# EasyEDA Pro project EasyEda.epro, board Right Hand
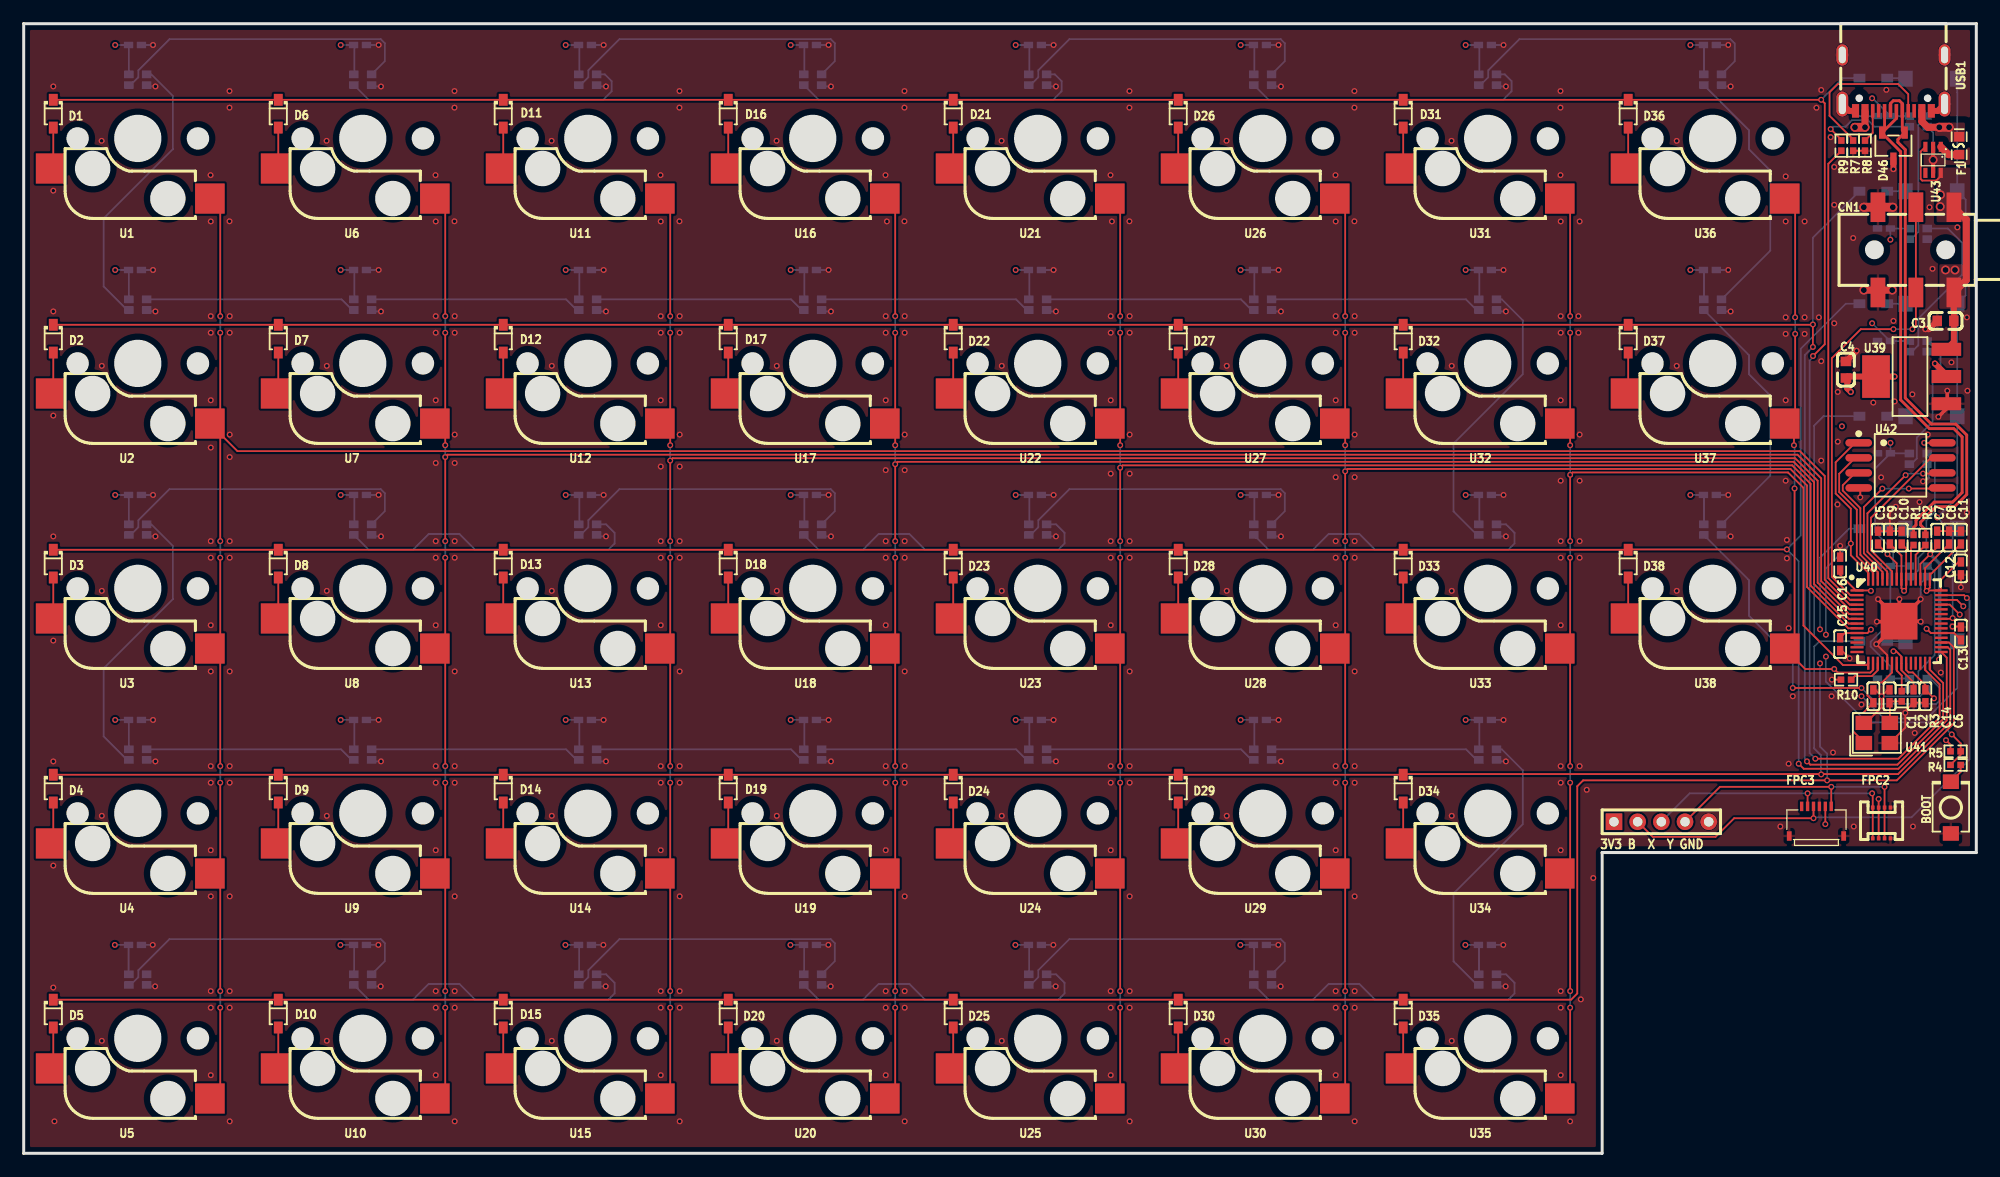
[diagram p7: board, top side]
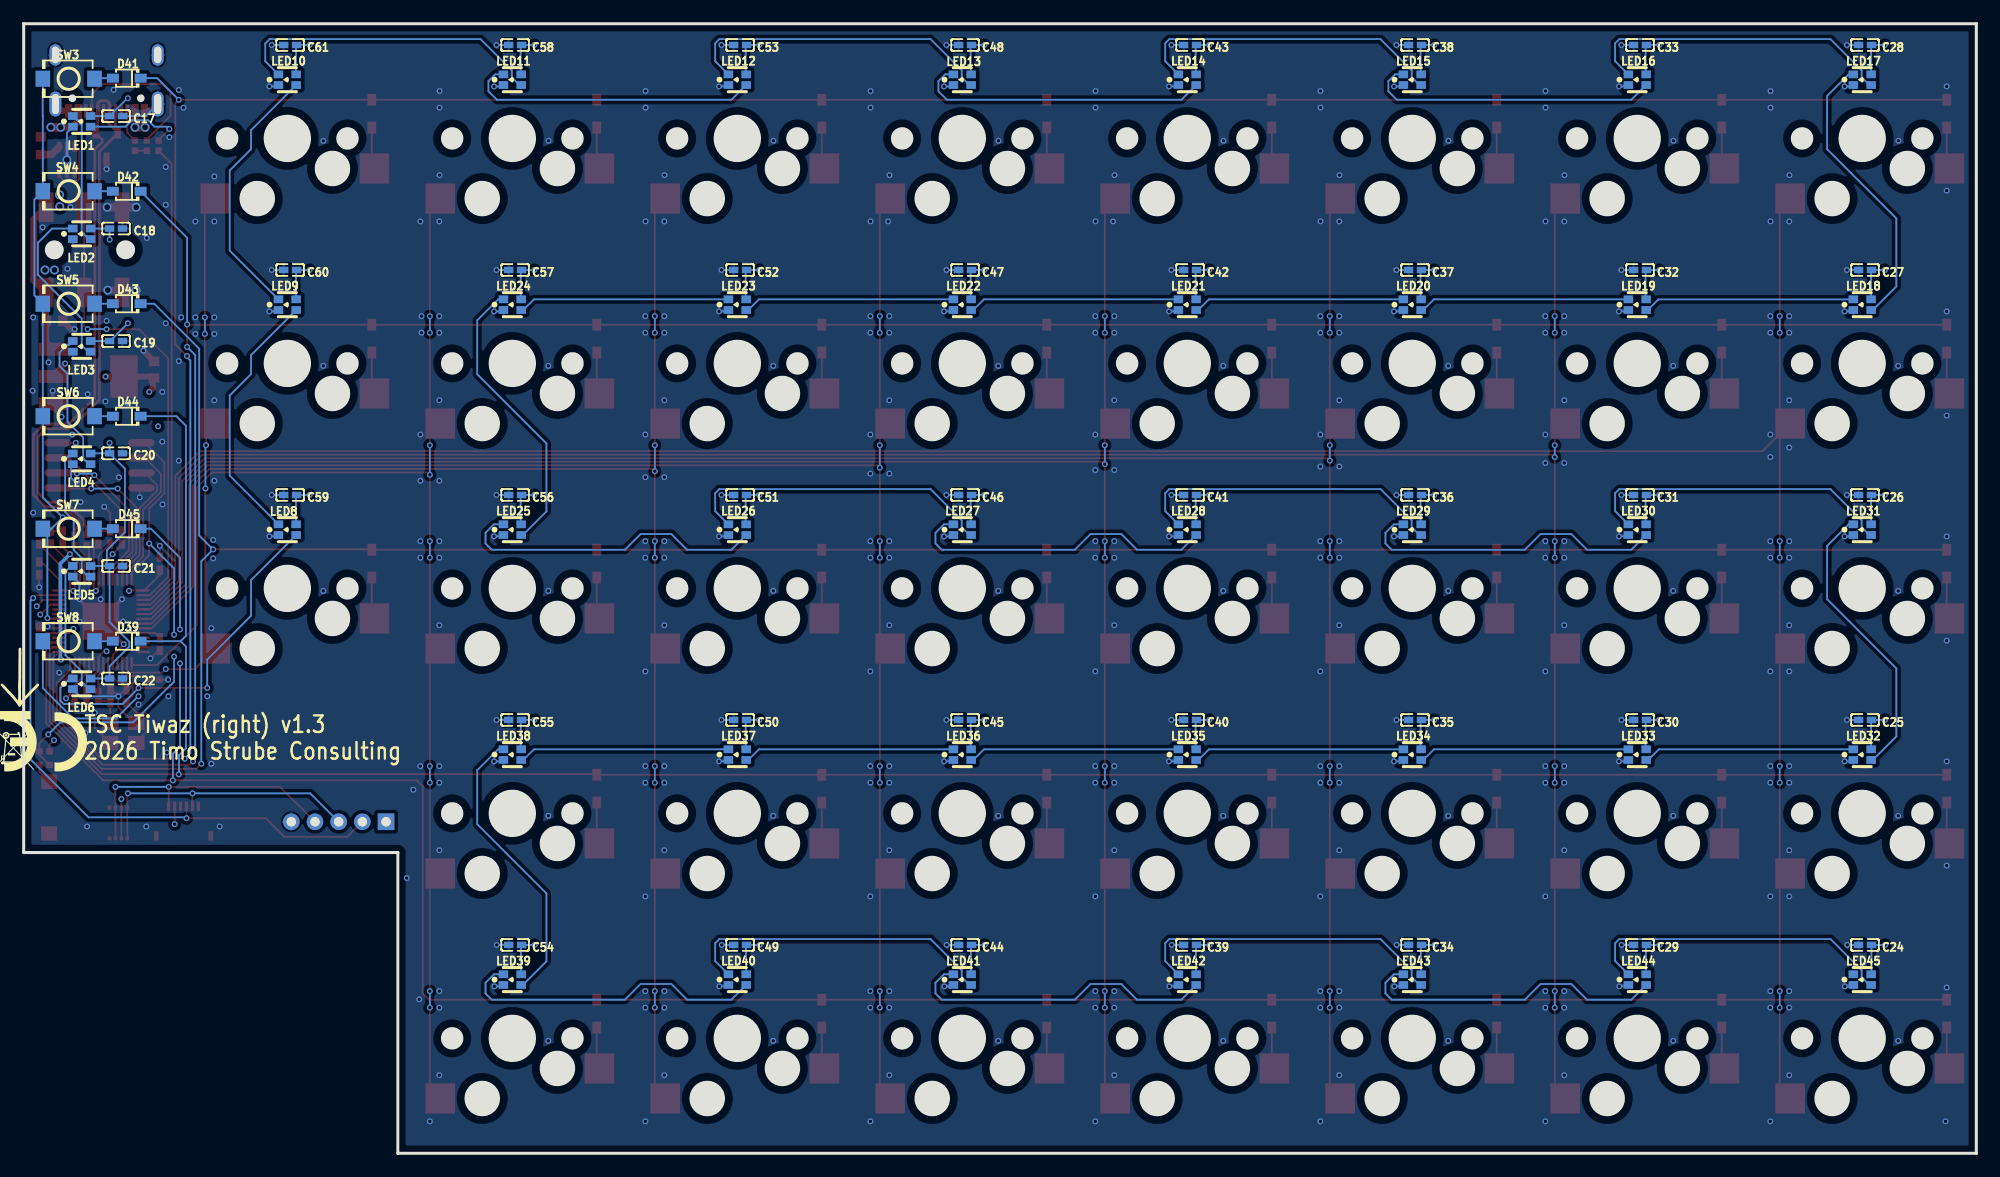
[diagram p8: board, bottom side, seen from below]

Outline 164.9 x 95.4 mm; copper layers: Top Layer, Inner1, Inner2, Bottom Layer. Coordinates in mm from the lower left corner of the outline.
Outline path: 0,95.4 164.9,95.4 164.9,25.4 133.3,25.4 133.3,0 0,0 0,95.4
Stack: Top Layer 0.035mm Outer layer thickness 1oz / Dielectric1 0.2104mm 7628 RC49% 8.6mil / Inner1 0.0152mm Inner layer thickness / Dielectric2 1.065mm 1.1mm H/HOZ Copper / Inner2 0.0152mm Inner layer thickness / Dielectric3 0.2104mm 7628 RC49% 8.6mil / Bottom Layer 0.035mm Outer layer thickness 1oz

## Design rules (mm)
template: User Custom Config
spacing Default (default): track to track 0.15, other pairs 0 to 1
track width Default (default): min 0.15, default 0.15, max 25.4
differential pair differentialPair (default): width min 0.127, default 0.254, max 2.54; gap min 0.152, default 0.152
differential pair USB 12Mbps: width min 0.24, default 0.24, max 0.24; gap min 0.15, default 0.15
via Default (default): diameter min 0.5, default 0.5, max 100.025; hole min 0.3, default 0.3, max 59.995
net $1I35159\$1N29010 uses Full
net $1I35159\VBUS uses PWR
pour e92 uses Full
pour e10568 uses Full
pour e11129 uses PWR

## Placement (name value [footprint] x y rotation side)
BOOT  TS-1088-AR02016  [SW-SMD_L3.9-W3.0-P4.45]  162.75 29.2 90 top
C1  15pF  [C0402]  156.21 38.6 90 top
C2  15pF  [C0402]  157.57 38.6 270 top
C3  10uF  [C0603]  162.3 70.3 0 top
C4  10uF  [C0603]  153.89 66.18 270 top
C5  100nF  [C0402]  156.6 52 270 top
C6  100nF  [C0402]  160.6 38.6 90 top
C7  1uF  [C0402]  161.6 52 270 top
C8  1uF  [C0402]  162.6 52 90 top
C9  100nF  [C0402]  157.6 52 270 top
C10  100nF  [C0402]  158.6 52 270 top
C11  100nF  [C0402]  163.6 52 270 top
C12  100nF  [C0402]  163.6 49.4 90 top
C13  100nF  [C0402]  163.6 43.9 270 top
C14  100nF  [C0402]  159.6 38.6 90 top
C15  100nF  [C0402]  153.4 43 90 top
C16  100nF  [C0402]  153.4 49.8 270 top
C17  100nF  [C0402]  157.1 87.6 0 bottom
C18  100nF  [C0402]  157.1 78.1 0 bottom
C19  100nF  [C0402]  157.1 68.6 0 bottom
C20  100nF  [C0402]  157.1 59.12 0 bottom
C21  100nF  [C0402]  157.1 49.6 0 bottom
C22  100nF  [C0402]  157.1 40.1 0 bottom
C24  100nF  [C0402]  9.4 17.6 180 bottom
C25  100nF  [C0402]  9.4 36.6 180 bottom
C26  100nF  [C0402]  9.4 55.6 180 bottom
C27  100nF  [C0402]  9.4 74.6 180 bottom
C28  100nF  [C0402]  9.4 93.6 180 bottom
C29  100nF  [C0402]  28.4 17.6 180 bottom
C30  100nF  [C0402]  28.4 36.6 180 bottom
C31  100nF  [C0402]  28.4 55.6 180 bottom
C32  100nF  [C0402]  28.4 74.6 180 bottom
C33  100nF  [C0402]  28.4 93.6 180 bottom
C34  100nF  [C0402]  47.4 17.6 180 bottom
C35  100nF  [C0402]  47.4 36.6 180 bottom
C36  100nF  [C0402]  47.4 55.6 180 bottom
C37  100nF  [C0402]  47.4 74.6 180 bottom
C38  100nF  [C0402]  47.4 93.6 180 bottom
C39  100nF  [C0402]  66.4 17.6 180 bottom
C40  100nF  [C0402]  66.4 36.6 180 bottom
C41  100nF  [C0402]  66.4 55.6 180 bottom
C42  100nF  [C0402]  66.4 74.6 180 bottom
C43  100nF  [C0402]  66.4 93.6 180 bottom
C44  100nF  [C0402]  85.4 17.6 180 bottom
C45  100nF  [C0402]  85.4 36.6 180 bottom
C46  100nF  [C0402]  85.4 55.6 180 bottom
C47  100nF  [C0402]  85.4 74.6 180 bottom
C48  100nF  [C0402]  85.4 93.6 180 bottom
C49  100nF  [C0402]  104.4 17.6 180 bottom
C50  100nF  [C0402]  104.4 36.6 180 bottom
C51  100nF  [C0402]  104.4 55.6 180 bottom
C52  100nF  [C0402]  104.4 74.6 180 bottom
C53  100nF  [C0402]  104.4 93.6 180 bottom
C54  100nF  [C0402]  123.4 17.6 180 bottom
C55  100nF  [C0402]  123.4 36.6 180 bottom
C56  100nF  [C0402]  123.4 55.6 180 bottom
C57  100nF  [C0402]  123.4 74.6 180 bottom
C58  100nF  [C0402]  123.4 93.6 180 bottom
C59  100nF  [C0402]  142.4 55.6 180 bottom
C60  100nF  [C0402]  142.4 74.6 180 bottom
C61  100nF  [C0402]  142.4 93.6 180 bottom
CN1  PJ-313D  [AUDIO-SMD_PJ-313D-2]  159.8 76.3 270 top
D1  1N4148WS  [SOD-323_L1.8-W1.3-LS2.5-RD]  2.5 87.8 270 top
D2  1N4148WS  [SOD-323_L1.8-W1.3-LS2.5-RD]  2.5 68.8 270 top
D3  1N4148WS  [SOD-323_L1.8-W1.3-LS2.5-RD]  2.5 49.8 270 top
D4  1N4148WS  [SOD-323_L1.8-W1.3-LS2.5-RD]  2.5 30.8 270 top
D5  1N4148WS  [SOD-323_L1.8-W1.3-LS2.5-RD]  2.5 11.8 270 top
D6  1N4148WS  [SOD-323_L1.8-W1.3-LS2.5-RD]  21.5 87.8 270 top
D7  1N4148WS  [SOD-323_L1.8-W1.3-LS2.5-RD]  21.5 68.8 270 top
D8  1N4148WS  [SOD-323_L1.8-W1.3-LS2.5-RD]  21.5 49.8 270 top
D9  1N4148WS  [SOD-323_L1.8-W1.3-LS2.5-RD]  21.5 30.8 270 top
D10  1N4148WS  [SOD-323_L1.8-W1.3-LS2.5-RD]  21.5 11.8 270 top
D11  1N4148WS  [SOD-323_L1.8-W1.3-LS2.5-RD]  40.5 87.8 270 top
D12  1N4148WS  [SOD-323_L1.8-W1.3-LS2.5-RD]  40.5 68.8 270 top
D13  1N4148WS  [SOD-323_L1.8-W1.3-LS2.5-RD]  40.5 49.8 270 top
D14  1N4148WS  [SOD-323_L1.8-W1.3-LS2.5-RD]  40.5 30.8 270 top
D15  1N4148WS  [SOD-323_L1.8-W1.3-LS2.5-RD]  40.5 11.8 270 top
D16  1N4148WS  [SOD-323_L1.8-W1.3-LS2.5-RD]  59.5 87.8 270 top
D17  1N4148WS  [SOD-323_L1.8-W1.3-LS2.5-RD]  59.5 68.8 270 top
D18  1N4148WS  [SOD-323_L1.8-W1.3-LS2.5-RD]  59.5 49.8 270 top
D19  1N4148WS  [SOD-323_L1.8-W1.3-LS2.5-RD]  59.5 30.8 270 top
D20  1N4148WS  [SOD-323_L1.8-W1.3-LS2.5-RD]  59.5 11.8 270 top
D21  1N4148WS  [SOD-323_L1.8-W1.3-LS2.5-RD]  78.5 87.8 270 top
D22  1N4148WS  [SOD-323_L1.8-W1.3-LS2.5-RD]  78.5 68.8 270 top
D23  1N4148WS  [SOD-323_L1.8-W1.3-LS2.5-RD]  78.5 49.8 270 top
D24  1N4148WS  [SOD-323_L1.8-W1.3-LS2.5-RD]  78.5 30.8 270 top
D25  1N4148WS  [SOD-323_L1.8-W1.3-LS2.5-RD]  78.5 11.8 270 top
D26  1N4148WS  [SOD-323_L1.8-W1.3-LS2.5-RD]  97.5 87.8 270 top
D27  1N4148WS  [SOD-323_L1.8-W1.3-LS2.5-RD]  97.5 68.8 270 top
D28  1N4148WS  [SOD-323_L1.8-W1.3-LS2.5-RD]  97.5 49.8 270 top
D29  1N4148WS  [SOD-323_L1.8-W1.3-LS2.5-RD]  97.5 30.8 270 top
D30  1N4148WS  [SOD-323_L1.8-W1.3-LS2.5-RD]  97.5 11.8 270 top
D31  1N4148WS  [SOD-323_L1.8-W1.3-LS2.5-RD]  116.5 87.8 270 top
D32  1N4148WS  [SOD-323_L1.8-W1.3-LS2.5-RD]  116.5 68.8 270 top
D33  1N4148WS  [SOD-323_L1.8-W1.3-LS2.5-RD]  116.5 49.8 270 top
D34  1N4148WS  [SOD-323_L1.8-W1.3-LS2.5-RD]  116.5 30.8 270 top
D35  1N4148WS  [SOD-323_L1.8-W1.3-LS2.5-RD]  116.5 11.8 270 top
D36  1N4148WS  [SOD-323_L1.8-W1.3-LS2.5-RD]  135.5 87.8 270 top
D37  1N4148WS  [SOD-323_L1.8-W1.3-LS2.5-RD]  135.5 68.8 270 top
D38  1N4148WS  [SOD-323_L1.8-W1.3-LS2.5-RD]  135.5 49.8 270 top
D39  1N4148WS  [SOD-323_L1.8-W1.3-LS2.5-RD]  156.2 43.25 0 bottom
D41  1N4148WS  [SOD-323_L1.8-W1.3-LS2.5-RD]  156.2 90.8 0 bottom
D42  1N4148WS  [SOD-323_L1.8-W1.3-LS2.5-RD]  156.2 81.25 0 bottom
D43  1N4148WS  [SOD-323_L1.8-W1.3-LS2.5-RD]  156.2 71.75 0 bottom
D44  1N4148WS  [SOD-323_L1.8-W1.3-LS2.5-RD]  156.2 62.25 0 bottom
D45  1N4148WS  [SOD-323_L1.8-W1.3-LS2.5-RD]  156.2 52.75 0 bottom
D46  ESDA6V1L  [SOT-23-3_L3.0-W1.7-P0.95-LS2.9-BR]  157.9 85.1 90 top
F1  BSMD0603-100-6V  [F0603]  163.45 85.1 270 top
FPC2  FA1004SA1-R8000  [CONN-SMD_FA1004SA1-R8000]  156.9 27.9 0 top
FPC3  FH19C-6S-0.5SH(10)  [FPC-SMD_FH19C-6S-0.5SH]  151.4 28.05 0 top
H1  XY-PZ200V-11-05P  [HDR-TH_XY-PZ200V-11-05P]  138.3 28 0 top
LED1  XL-1615RGBC-WS2812B  [LED-SMD_4P-L1.6-W1.5_XL-1615RGBC-WS2812B-1]  160 87.15 180 bottom
LED2  XL-1615RGBC-WS2812B  [LED-SMD_4P-L1.6-W1.5_XL-1615RGBC-WS2812B-1]  160 77.65 180 bottom
LED3  XL-1615RGBC-WS2812B  [LED-SMD_4P-L1.6-W1.5_XL-1615RGBC-WS2812B-1]  160 68.15 180 bottom
LED4  XL-1615RGBC-WS2812B  [LED-SMD_4P-L1.6-W1.5_XL-1615RGBC-WS2812B-1]  160 58.65 180 bottom
LED5  XL-1615RGBC-WS2812B  [LED-SMD_4P-L1.6-W1.5_XL-1615RGBC-WS2812B-1]  160 49.15 180 bottom
LED6  XL-1615RGBC-WS2812B  [LED-SMD_4P-L1.6-W1.5_XL-1615RGBC-WS2812B-1]  160 39.65 180 bottom
LED8  XL-1615RGBC-WS2812B  [LED-SMD_4P-L1.6-W1.5_XL-1615RGBC-WS2812B-1]  142.63 52.67 180 bottom
LED9  XL-1615RGBC-WS2812B  [LED-SMD_4P-L1.6-W1.5_XL-1615RGBC-WS2812B-1]  142.63 71.67 180 bottom
LED10  XL-1615RGBC-WS2812B  [LED-SMD_4P-L1.6-W1.5_XL-1615RGBC-WS2812B-1]  142.63 90.67 180 bottom
LED11  XL-1615RGBC-WS2812B  [LED-SMD_4P-L1.6-W1.5_XL-1615RGBC-WS2812B-1]  123.63 90.67 180 bottom
LED12  XL-1615RGBC-WS2812B  [LED-SMD_4P-L1.6-W1.5_XL-1615RGBC-WS2812B-1]  104.63 90.67 180 bottom
LED13  XL-1615RGBC-WS2812B  [LED-SMD_4P-L1.6-W1.5_XL-1615RGBC-WS2812B-1]  85.63 90.67 180 bottom
LED14  XL-1615RGBC-WS2812B  [LED-SMD_4P-L1.6-W1.5_XL-1615RGBC-WS2812B-1]  66.63 90.67 180 bottom
LED15  XL-1615RGBC-WS2812B  [LED-SMD_4P-L1.6-W1.5_XL-1615RGBC-WS2812B-1]  47.64 90.67 180 bottom
LED16  XL-1615RGBC-WS2812B  [LED-SMD_4P-L1.6-W1.5_XL-1615RGBC-WS2812B-1]  28.64 90.67 180 bottom
LED17  XL-1615RGBC-WS2812B  [LED-SMD_4P-L1.6-W1.5_XL-1615RGBC-WS2812B-1]  9.64 90.67 180 bottom
LED18  XL-1615RGBC-WS2812B  [LED-SMD_4P-L1.6-W1.5_XL-1615RGBC-WS2812B-1]  9.64 71.67 180 bottom
LED19  XL-1615RGBC-WS2812B  [LED-SMD_4P-L1.6-W1.5_XL-1615RGBC-WS2812B-1]  28.64 71.67 180 bottom
LED20  XL-1615RGBC-WS2812B  [LED-SMD_4P-L1.6-W1.5_XL-1615RGBC-WS2812B-1]  47.64 71.67 180 bottom
LED21  XL-1615RGBC-WS2812B  [LED-SMD_4P-L1.6-W1.5_XL-1615RGBC-WS2812B-1]  66.63 71.67 180 bottom
LED22  XL-1615RGBC-WS2812B  [LED-SMD_4P-L1.6-W1.5_XL-1615RGBC-WS2812B-1]  85.63 71.67 180 bottom
LED23  XL-1615RGBC-WS2812B  [LED-SMD_4P-L1.6-W1.5_XL-1615RGBC-WS2812B-1]  104.63 71.67 180 bottom
LED24  XL-1615RGBC-WS2812B  [LED-SMD_4P-L1.6-W1.5_XL-1615RGBC-WS2812B-1]  123.63 71.67 180 bottom
LED25  XL-1615RGBC-WS2812B  [LED-SMD_4P-L1.6-W1.5_XL-1615RGBC-WS2812B-1]  123.63 52.67 180 bottom
LED26  XL-1615RGBC-WS2812B  [LED-SMD_4P-L1.6-W1.5_XL-1615RGBC-WS2812B-1]  104.63 52.67 180 bottom
LED27  XL-1615RGBC-WS2812B  [LED-SMD_4P-L1.6-W1.5_XL-1615RGBC-WS2812B-1]  85.63 52.67 180 bottom
LED28  XL-1615RGBC-WS2812B  [LED-SMD_4P-L1.6-W1.5_XL-1615RGBC-WS2812B-1]  66.63 52.67 180 bottom
LED29  XL-1615RGBC-WS2812B  [LED-SMD_4P-L1.6-W1.5_XL-1615RGBC-WS2812B-1]  47.64 52.67 180 bottom
LED30  XL-1615RGBC-WS2812B  [LED-SMD_4P-L1.6-W1.5_XL-1615RGBC-WS2812B-1]  28.64 52.67 180 bottom
LED31  XL-1615RGBC-WS2812B  [LED-SMD_4P-L1.6-W1.5_XL-1615RGBC-WS2812B-1]  9.64 52.67 180 bottom
LED32  XL-1615RGBC-WS2812B  [LED-SMD_4P-L1.6-W1.5_XL-1615RGBC-WS2812B-1]  9.64 33.67 180 bottom
LED33  XL-1615RGBC-WS2812B  [LED-SMD_4P-L1.6-W1.5_XL-1615RGBC-WS2812B-1]  28.64 33.67 180 bottom
LED34  XL-1615RGBC-WS2812B  [LED-SMD_4P-L1.6-W1.5_XL-1615RGBC-WS2812B-1]  47.64 33.67 180 bottom
LED35  XL-1615RGBC-WS2812B  [LED-SMD_4P-L1.6-W1.5_XL-1615RGBC-WS2812B-1]  66.63 33.67 180 bottom
LED36  XL-1615RGBC-WS2812B  [LED-SMD_4P-L1.6-W1.5_XL-1615RGBC-WS2812B-1]  85.63 33.67 180 bottom
LED37  XL-1615RGBC-WS2812B  [LED-SMD_4P-L1.6-W1.5_XL-1615RGBC-WS2812B-1]  104.63 33.67 180 bottom
LED38  XL-1615RGBC-WS2812B  [LED-SMD_4P-L1.6-W1.5_XL-1615RGBC-WS2812B-1]  123.63 33.67 180 bottom
LED39  XL-1615RGBC-WS2812B  [LED-SMD_4P-L1.6-W1.5_XL-1615RGBC-WS2812B-1]  123.63 14.67 180 bottom
LED40  XL-1615RGBC-WS2812B  [LED-SMD_4P-L1.6-W1.5_XL-1615RGBC-WS2812B-1]  104.63 14.67 180 bottom
LED41  XL-1615RGBC-WS2812B  [LED-SMD_4P-L1.6-W1.5_XL-1615RGBC-WS2812B-1]  85.63 14.67 180 bottom
LED42  XL-1615RGBC-WS2812B  [LED-SMD_4P-L1.6-W1.5_XL-1615RGBC-WS2812B-1]  66.63 14.67 180 bottom
LED43  XL-1615RGBC-WS2812B  [LED-SMD_4P-L1.6-W1.5_XL-1615RGBC-WS2812B-1]  47.64 14.67 180 bottom
LED44  XL-1615RGBC-WS2812B  [LED-SMD_4P-L1.6-W1.5_XL-1615RGBC-WS2812B-1]  28.64 14.67 180 bottom
LED45  XL-1615RGBC-WS2812B  [LED-SMD_4P-L1.6-W1.5_XL-1615RGBC-WS2812B-1]  9.64 14.67 180 bottom
R1  22Ω  [R0402]  159.6 51.8 270 top
R2  22Ω  [R0402]  160.6 51.8 270 top
R3  1kΩ  [R0402]  158.6 38.6 270 top
R4  1kΩ  [R0402]  163.15 32.8 0 top
R5  10kΩ  [R0402]  163.15 33.95 180 top
R7  5.1kΩ  [R0402]  154.5 85.1 90 top
R8  5.1kΩ  [R0402]  155.5 85.1 90 top
R9  330Ω  [R0402]  153.5 85.1 270 top
R10  10kΩ  [R0402]  153.9 40 180 top
SW3  TS-1088-AR02016  [SW-SMD_L3.9-W3.0-P4.45]  161.1 90.75 0 bottom
SW4  TS-1088-AR02016  [SW-SMD_L3.9-W3.0-P4.45]  161.1 81.25 0 bottom
SW5  TS-1088-AR02016  [SW-SMD_L3.9-W3.0-P4.45]  161.1 71.75 0 bottom
SW6  TS-1088-AR02016  [SW-SMD_L3.9-W3.0-P4.45]  161.1 62.25 0 bottom
SW7  TS-1088-AR02016  [SW-SMD_L3.9-W3.0-P4.45]  161.1 52.75 0 bottom
SW8  TS-1088-AR02016  [SW-SMD_L3.9-W3.0-P4.45]  161.1 43.25 0 bottom
U1  CPG151101S11-16  [SMD_KEYBOARD-SW_COMPLETE]  9 81.9 0 top
U2  CPG151101S11-16  [SMD_KEYBOARD-SW_COMPLETE]  9 62.9 0 top
U3  CPG151101S11-16  [SMD_KEYBOARD-SW_COMPLETE]  9 43.9 0 top
U4  CPG151101S11-16  [SMD_KEYBOARD-SW_COMPLETE]  9 24.9 0 top
U5  CPG151101S11-16  [SMD_KEYBOARD-SW_COMPLETE]  9 5.9 0 top
U6  CPG151101S11-16  [SMD_KEYBOARD-SW_COMPLETE]  28 81.9 0 top
U7  CPG151101S11-16  [SMD_KEYBOARD-SW_COMPLETE]  28 62.9 0 top
U8  CPG151101S11-16  [SMD_KEYBOARD-SW_COMPLETE]  28 43.9 0 top
U9  CPG151101S11-16  [SMD_KEYBOARD-SW_COMPLETE]  28 24.9 0 top
U10  CPG151101S11-16  [SMD_KEYBOARD-SW_COMPLETE]  28 5.9 0 top
U11  CPG151101S11-16  [SMD_KEYBOARD-SW_COMPLETE]  47 81.9 0 top
U12  CPG151101S11-16  [SMD_KEYBOARD-SW_COMPLETE]  47 62.9 0 top
U13  CPG151101S11-16  [SMD_KEYBOARD-SW_COMPLETE]  47 43.9 0 top
U14  CPG151101S11-16  [SMD_KEYBOARD-SW_COMPLETE]  47 24.9 0 top
U15  CPG151101S11-16  [SMD_KEYBOARD-SW_COMPLETE]  47 5.9 0 top
U16  CPG151101S11-16  [SMD_KEYBOARD-SW_COMPLETE]  66 81.9 0 top
U17  CPG151101S11-16  [SMD_KEYBOARD-SW_COMPLETE]  66 62.9 0 top
U18  CPG151101S11-16  [SMD_KEYBOARD-SW_COMPLETE]  66 43.9 0 top
U19  CPG151101S11-16  [SMD_KEYBOARD-SW_COMPLETE]  66 24.9 0 top
U20  CPG151101S11-16  [SMD_KEYBOARD-SW_COMPLETE]  66 5.9 0 top
U21  CPG151101S11-16  [SMD_KEYBOARD-SW_COMPLETE]  85 81.9 0 top
U22  CPG151101S11-16  [SMD_KEYBOARD-SW_COMPLETE]  85 62.9 0 top
U23  CPG151101S11-16  [SMD_KEYBOARD-SW_COMPLETE]  85 43.9 0 top
U24  CPG151101S11-16  [SMD_KEYBOARD-SW_COMPLETE]  85 24.9 0 top
U25  CPG151101S11-16  [SMD_KEYBOARD-SW_COMPLETE]  85 5.9 0 top
U26  CPG151101S11-16  [SMD_KEYBOARD-SW_COMPLETE]  104 81.9 0 top
U27  CPG151101S11-16  [SMD_KEYBOARD-SW_COMPLETE]  104 62.9 0 top
U28  CPG151101S11-16  [SMD_KEYBOARD-SW_COMPLETE]  104 43.9 0 top
U29  CPG151101S11-16  [SMD_KEYBOARD-SW_COMPLETE]  104 24.9 0 top
U30  CPG151101S11-16  [SMD_KEYBOARD-SW_COMPLETE]  104 5.9 0 top
U31  CPG151101S11-16  [SMD_KEYBOARD-SW_COMPLETE]  123 81.9 0 top
U32  CPG151101S11-16  [SMD_KEYBOARD-SW_COMPLETE]  123 62.9 0 top
U33  CPG151101S11-16  [SMD_KEYBOARD-SW_COMPLETE]  123 43.9 0 top
U34  CPG151101S11-16  [SMD_KEYBOARD-SW_COMPLETE]  123 24.9 0 top
U35  CPG151101S11-16  [SMD_KEYBOARD-SW_COMPLETE]  123 5.9 0 top
U36  CPG151101S11-16  [SMD_KEYBOARD-SW_COMPLETE]  142 81.9 0 top
U37  CPG151101S11-16  [SMD_KEYBOARD-SW_COMPLETE]  142 62.9 0 top
U38  CPG151101S11-16  [SMD_KEYBOARD-SW_COMPLETE]  142 43.9 0 top
U39  AMS1117-3.3  [SOT-223-3_L6.5-W3.4-P2.30-LS7.0-BR]  159.4 65.6 0 top
U40  RP2040  [LQFN-56_L7.0-W7.0-P0.4-EP]  158.38 44.94 0 top
U41  ABM8-272-T3  [CRYSTAL-SMD_4P-L3.2-W2.5-BL]  156.5 35.5 0 top
U42  W25Q16JVSSIQ  [SOIC-8_L5.3-W5.3-P1.27-LS8.0-BL]  158.5 58.1 270 top
U43  LM66100DCKR  [SC-70-6_L2.0-W1.3-P0.65-LS2.1-BL]  161.25 83.9 180 top
USB1  TYPE-C16PIN  [USB-C-SMD_TYPE-C16PIN]  157.9 90.4 180 top

## Footprints (pads in the part's own frame, mm; a bottom-side part is the same pattern mirrored in y, then rotated)
AUDIO-SMD_PJ-313D-2
  rect 2.5x1.25 smd: 1(-3.6,3.205) 1(3.6,3.205) 2(-3.6,-0.005) 2(3.6,-0.005) 3(-3.6,-3.205) 3(3.6,-3.205)
C0402
  rect 0.79x0.54 smd: 1(-0.545,0) 2(0.545,0)
C0603
  rect 0.8x0.9 smd: 1(-0.7,0) 2(0.7,0)
CONN-SMD_FA1004SA1-R8000
  rect 0.3x0.35 smd: 1(-0.75,-1.3) 2(-0.25,-1.3) 3(0.25,-1.3) 4(0.75,-1.3) 5(-0.75,1.3) 6(-0.25,1.3) 7(0.25,1.3) 8(0.75,1.3)
CRYSTAL-SMD_4P-L3.2-W2.5-BL
  rect 1.4x1.2 smd: 1(-1.1,-0.85) 2(1.1,-0.85) 3(1.1,0.85) 4(-1.1,0.85)
F0603
  rect 0.806x0.864 smd: 1(-0.753,0) 2(0.753,0)
FPC-SMD_FH19C-6S-0.5SH
  rect 0.28x0.8 smd: 1(-1.25,1.25) 2(-0.75,1.25) 3(-0.25,1.25) 4(0.25,1.25) 5(0.75,1.25) 6(1.25,1.25)
  rect 0.4x0.8 smd: 7(2.3,-1.25) 8(-2.3,-1.25)
HDR-TH_XY-PZ200V-11-05P
  rect 1.4x1.4 hole 0.8: 1(-4,0)
  round 1.4 hole 0.8: 2(-2,0) 3(0,0) 4(2,0) 5(4,0)
LED-SMD_4P-L1.6-W1.5_XL-1615RGBC-WS2812B-1
  rect 0.8x0.65 smd: 1(-0.75,-0.45) 2(0.75,-0.45) 3(0.75,0.45) 4(-0.75,0.45)
LQFN-56_L7.0-W7.0-P0.4-EP
  rect 1.1x0.2 smd: 1(-3.55,2.6) 2(-3.55,2.2) 3(-3.55,1.8) 4(-3.55,1.4) 5(-3.55,1) 6(-3.55,0.6) 7(-3.55,0.2) 8(-3.55,-0.2) 9(-3.55,-0.6) 10(-3.55,-1) 11(-3.55,-1.4) 12(-3.55,-1.8) 13(-3.55,-2.2) 14(-3.55,-2.6) 29(3.55,-2.6) 30(3.55,-2.2) 31(3.55,-1.8) 32(3.55,-1.4) 33(3.55,-1) 34(3.55,-0.6) 35(3.55,-0.2) 36(3.55,0.2) 37(3.55,0.6) 38(3.55,1) 39(3.55,1.4) 40(3.55,1.8) 41(3.55,2.2) 42(3.55,2.6)
  rect 0.2x1.1 smd: 15(-2.6,-3.55) 16(-2.2,-3.55) 17(-1.8,-3.55) 18(-1.4,-3.55) 19(-1,-3.55) 20(-0.6,-3.55) 21(-0.2,-3.55) 22(0.2,-3.55) 23(0.6,-3.55) 24(1,-3.55) 25(1.4,-3.55) 26(1.8,-3.55) 27(2.2,-3.55) 28(2.6,-3.55) 43(2.6,3.55) 44(2.2,3.55) 45(1.8,3.55) 46(1.4,3.55) 47(1,3.55) 48(0.6,3.55) 49(0.2,3.55) 50(-0.2,3.55) 51(-0.6,3.55) 52(-1,3.55) 53(-1.4,3.55) 54(-1.8,3.55) 55(-2.2,3.55) 56(-2.6,3.55)
  rect 3.1x3.1 smd: 57(0,0)
R0402
  rect 0.566x0.54 smd: 1(-0.433,0) 2(0.433,0)
SC-70-6_L2.0-W1.3-P0.65-LS2.1-BL
  rect 0.35x0.85 smd: 1(-0.65,-1.1) 2(0,-1.1) 3(0.65,-1.1) 4(0.65,1.1) 5(0,1.1) 6(-0.65,1.1)
SMD_KEYBOARD-SW_COMPLETE
  rect 2.5x2.55 smd: 1(-6.725,1.27) 2(6.725,-1.27)
SOD-323_L1.8-W1.3-LS2.5-RD
  rect 1x0.75 smd: 1(-1.173,0) 2(1.173,0)
SOIC-8_L5.3-W5.3-P1.27-LS8.0-BL
  oval 0.63x2.25 smd: 1(-1.905,-3.53) 2(-0.635,-3.53) 3(0.635,-3.53) 4(1.905,-3.53) 5(1.905,3.53) 6(0.635,3.53) 7(-0.635,3.53) 8(-1.905,3.53)
SOT-23-3_L3.0-W1.7-P0.95-LS2.9-BR
  rect 1.038x0.532 smd: 1(1.101,-0.95) 2(1.101,0.95) 3(-1.101,0)
SOT-223-3_L6.5-W3.4-P2.30-LS7.0-BR
  rect 2.5x1.1 smd: 1(2.97,-2.3) 2(2.97,0) 3(2.97,2.3)
  rect 2.34x3.6 smd: 4(-2.97,0)
SW-SMD_L3.9-W3.0-P4.45
  rect 1.23x1.36 smd: 1(-2.185,0) 2(2.185,0)
USB-C-SMD_TYPE-C16PIN
  oval 1x2.1 hole 0.6x1.7: 1(-4.32,1.788) 2(4.32,1.788)
  oval 1x1.8 hole 0.6x1.4: 3(-4.32,-2.362) 4(4.32,-2.362)
  rect 0.6x1.15 smd: A1B12(-3.2,2.362) A4B9(-2.4,2.362) B1A12(3.2,2.362) B4A9(2.4,2.362)
  rect 0.3x1.15 smd: A5(-1.25,2.362) A6(-0.25,2.362) A7(0.25,2.362) A8(1.25,2.362) B5(1.75,2.362) B6(0.75,2.362) B7(-0.75,2.362) B8(-1.75,2.362)

## Nets
$1I35159\1V1: C5.2 C6.2 C7.2 U40.23 U40.45 U40.50
$1I35159\3V3: C4.2 C8.1 C9.2 C10.2 C11.2 C12.2 C13.2 C14.2 C15.2 C16.2 FPC2.2 FPC2.6 FPC3.5 H1.1 R5.2 U39.2 U39.4 U40.1 U40.10 U40.22 U40.33 U40.42 U40.43 U40.44 U40.48 U40.49 U42.8
$1I35159\5V: C3.2 C17.2 C18.2 C19.2 C20.2 C21.2 C22.2 C24.2 C25.2 C26.2 C27.2 C28.2 C29.2 C30.2 C31.2 C32.2 C33.2 C34.2 C35.2 C36.2 C37.2 C38.2 C39.2 C40.2 C41.2 C42.2 C43.2 C44.2 C45.2 C46.2 C47.2 C48.2 C49.2 C50.2 C51.2 C52.2 C53.2 C54.2 C55.2 C56.2 C57.2 C58.2 C59.2 C60.2 C61.2 CN1.1 LED1.3 LED2.3 LED3.3 LED4.3 LED5.3 LED6.3 LED8.3 LED9.3 LED10.3 LED11.3 LED12.3 LED13.3 LED14.3 LED15.3 LED16.3 LED17.3 LED18.3 LED19.3 LED20.3 LED21.3 LED22.3 LED23.3 LED24.3 LED25.3 LED26.3 LED27.3 LED28.3 LED29.3 LED30.3 LED31.3 LED32.3 LED33.3 LED34.3 LED35.3 LED36.3 LED37.3 LED38.3 LED39.3 LED40.3 LED41.3 LED42.3 LED43.3 LED44.3 LED45.3 U39.3 U43.3 U43.6
$1I35159\$1N1: R1.2 U40.47
$1I35159\$1N6: C2.2 R3.2 U41.3
$1I35159\$1N17: R7.2 USB1.A5
$1I35159\$1N18: R8.2 USB1.B5
$1I35159\$1N2773: R2.2 U40.46
$1I35159\$1N2838: BOOT.2 R4.2
$1I35159\$1N29010: F1.2 U43.1
$1I35159\$6N6477: LED2.4 LED3.2
$1I35159\$6N6478: LED3.4 LED4.2
$1I35159\$6N6479: LED1.4 LED2.2
$1I35159\$6N6480: LED4.4 LED5.2
$1I35159\$6N6482: LED8.4 LED9.2
$1I35159\$6N6483: LED6.4 LED8.2
$1I35159\$6N6484: LED9.4 LED10.2
$1I35159\$6N6485: LED12.4 LED13.2
$1I35159\$6N6486: LED22.4 LED23.2
$1I35159\$6N6487: LED23.4 LED24.2
$1I35159\$6N6488: LED21.4 LED22.2
$1I35159\$6N6489: LED24.4 LED25.2
$1I35159\$6N6490: LED27.4 LED28.2
$1I35159\$6N6491: LED28.4 LED29.2
$1I35159\$6N6492: LED26.4 LED27.2
$1I35159\$6N6493: LED29.4 LED30.2
$1I35159\$6N6494: LED32.4 LED33.2
$1I35159\$6N6495: LED33.4 LED34.2
$1I35159\$6N6496: LED31.4 LED32.2
$1I35159\$6N6497: LED34.4 LED35.2
$1I35159\$6N6498: LED37.4 LED38.2
$1I35159\$6N6499: LED38.4 LED39.2
$1I35159\$6N6500: LED36.4 LED37.2
$1I35159\$6N6501: LED39.4 LED40.2
$1I35159\$6N6502: LED42.4 LED43.2
$1I35159\$6N6503: LED43.4 LED44.2
$1I35159\$6N6504: LED41.4 LED42.2
$1I35159\$6N6505: LED44.4 LED45.2
$1I35159\$6N6506: LED18.4 LED19.2
$1I35159\$6N6507: LED11.4 LED12.2
$1I35159\$6N6508: LED14.4 LED15.2
$1I35159\$6N6509: LED13.4 LED14.2
$1I35159\$6N6510: LED19.4 LED20.2
$1I35159\$6N6511: LED17.4 LED18.2
$1I35159\$6N6512: LED16.4 LED17.2
$1I35159\$6N6513: LED1.2 R9.1
$1I35159\$6N6516: LED5.4 LED6.2
$1I35159\$6N6517: LED10.4 LED11.2
$1I35159\$6N6518: LED15.4 LED16.2
$1I35159\$6N6519: LED20.4 LED21.2
$1I35159\$6N6520: LED25.4 LED26.2
$1I35159\$6N6521: LED30.4 LED31.2
$1I35159\$6N6522: LED35.4 LED36.2
$1I35159\$6N6523: LED40.4 LED41.2
$1I35159\$7N3321: D1.2 U1.1
$1I35159\$7N3322: D3.2 U3.1
$1I35159\$7N3323: D4.2 U4.1
$1I35159\$7N3324: D5.2 U5.1
$1I35159\$7N3325: D6.2 U6.1
$1I35159\$7N3326: D7.2 U7.1
$1I35159\$7N3327: D8.2 U8.1
$1I35159\$7N3328: D9.2 U9.1
$1I35159\$7N3329: D10.2 U10.1
$1I35159\$7N3330: D11.2 U11.1
$1I35159\$7N3331: D12.2 U12.1
$1I35159\$7N3332: D13.2 U13.1
$1I35159\$7N3333: D14.2 U14.1
$1I35159\$7N3334: D15.2 U15.1
$1I35159\$7N3335: D16.2 U16.1
$1I35159\$7N3336: D17.2 U17.1
$1I35159\$7N3337: D18.2 U18.1
$1I35159\$7N3338: D19.2 U19.1
$1I35159\$7N3339: D20.2 U20.1
$1I35159\$7N3340: D21.2 U21.1
$1I35159\$7N3341: D22.2 U22.1
$1I35159\$7N3342: D23.2 U23.1
$1I35159\$7N3343: D24.2 U24.1
$1I35159\$7N3344: D25.2 U25.1
$1I35159\$7N3345: D26.2 U26.1
$1I35159\$7N3346: D27.2 U27.1
$1I35159\$7N3347: D28.2 U28.1
$1I35159\$7N3348: D29.2 U29.1
$1I35159\$7N3349: D30.2 U30.1
$1I35159\$7N3350: D31.2 U31.1
$1I35159\$7N3351: D32.2 U32.1
$1I35159\$7N3352: D33.2 U33.1
$1I35159\$7N3353: D34.2 U34.1
$1I35159\$7N3354: D35.2 U35.1
$1I35159\$7N3355: D36.2 U36.1
$1I35159\$7N3356: D37.2 U37.1
$1I35159\$7N3357: D38.2 U38.1
$1I35159\$7N3358: D39.2 SW8.1
$1I35159\$7N3359: D41.2 SW3.1
$1I35159\$7N3360: D42.2 SW4.1
$1I35159\$7N3361: D43.2 SW5.1
$1I35159\$7N3362: D44.2 SW6.1
$1I35159\$7N3363: D45.2 SW7.1
$1I35159\$7N3393: D2.2 U2.1
$1I35159\COL1: U1.2 U2.2 U3.2 U4.2 U5.2 U40.4
$1I35159\COL2: U6.2 U7.2 U8.2 U9.2 U10.2 U40.5
$1I35159\COL3: U11.2 U12.2 U13.2 U14.2 U15.2 U40.6
$1I35159\COL4: U16.2 U17.2 U18.2 U19.2 U20.2 U40.7
$1I35159\COL5: U21.2 U22.2 U23.2 U24.2 U25.2 U40.8
$1I35159\COL6: U26.2 U27.2 U28.2 U29.2 U30.2 U40.9
$1I35159\COL7: U31.2 U32.2 U33.2 U34.2 U35.2 U40.15
$1I35159\COL8: SW8.2 U36.2 U37.2 U38.2 U40.16
$1I35159\COL9: SW3.2 SW4.2 SW5.2 SW6.2 SW7.2 U40.36
$1I35159\DI: R9.2 U40.3
$1I35159\JOY_B: FPC3.3 H1.2 U40.41
$1I35159\JOY_X: FPC2.1 FPC2.5 FPC3.2 H1.3 U40.40
$1I35159\JOY_Y: FPC2.3 FPC2.7 FPC3.6 H1.4 U40.39
$1I35159\QSPI_CLK: U40.52 U42.6
$1I35159\QSPI_CS: R4.1 R5.1 U40.56 U42.1
$1I35159\QSPI_IO0: U40.53 U42.5
$1I35159\QSPI_IO1: U40.55 U42.2
$1I35159\QSPI_IO2: U40.54 U42.3
$1I35159\QSPI_IO3: U40.51 U42.7
$1I35159\ROW1: D1.1 D6.1 D11.1 D16.1 D21.1 D26.1 D31.1 D36.1 D41.1 U40.27
$1I35159\ROW2: D2.1 D7.1 D12.1 D17.1 D22.1 D27.1 D32.1 D37.1 D42.1 U40.28
$1I35159\ROW3: D3.1 D8.1 D13.1 D18.1 D23.1 D28.1 D33.1 D38.1 D43.1 U40.29
$1I35159\ROW4: D4.1 D9.1 D14.1 D19.1 D24.1 D29.1 D34.1 D39.1 D44.1 U40.30
$1I35159\ROW5: D5.1 D10.1 D15.1 D20.1 D25.1 D30.1 D35.1 D45.1 U40.31
$1I35159\RUN: U40.26
$1I35159\SERIAL: CN1.2 U40.2
$1I35159\USB_D+: D46.2 R1.1 USB1.A6 USB1.B6
$1I35159\USB_D-: D46.1 R2.1 USB1.A7 USB1.B7
$1I35159\VBUS: F1.1 USB1.A4B9 USB1.B4A9
$1I35159\XIN: C1.1 U40.20 U41.1
$1I35159\XOUT: R3.1 U40.21
$1N35205: R10.1 U40.17
$1N35212: BOOT.1 C1.2 C2.1 C3.1 C4.1 C5.1 C6.1 C7.1 C8.2 C9.1 C10.1 C11.1 C12.1 C13.1 C14.1 C15.1 C16.1 C17.1 C18.1 C19.1 C20.1 C21.1 C22.1 C24.1 C25.1 C26.1 C27.1 C28.1 C29.1 C30.1 C31.1 C32.1 C33.1 C34.1 C35.1 C36.1 C37.1 C38.1 C39.1 C40.1 C41.1 C42.1 C43.1 C44.1 C45.1 C46.1 C47.1 C48.1 C49.1 C50.1 C51.1 C52.1 C53.1 C54.1 C55.1 C56.1 C57.1 C58.1 C59.1 C60.1 C61.1 CN1.3 D46.3 FPC2.4 FPC2.8 FPC3.4 FPC3.7 FPC3.8 H1.5 LED1.1 LED2.1 LED3.1 LED4.1 LED5.1 LED6.1 LED8.1 LED9.1 LED10.1 LED11.1 LED12.1 LED13.1 LED14.1 LED15.1 LED16.1 LED17.1 LED18.1 LED19.1 LED20.1 LED21.1 LED22.1 LED23.1 LED24.1 LED25.1 LED26.1 LED27.1 LED28.1 LED29.1 LED30.1 LED31.1 LED32.1 LED33.1 LED34.1 LED35.1 LED36.1 LED37.1 LED38.1 LED39.1 LED40.1 LED41.1 LED42.1 LED43.1 LED44.1 LED45.1 R7.1 R8.1 R10.2 U39.1 U40.19 U40.57 U41.2 U41.4 U42.4 U43.2 U43.5 USB1.1 USB1.2 USB1.3 USB1.4 USB1.A1B12 USB1.B1A12

Pads without a net: FPC3 1; LED45 4; U40 11 12 13 14 18 24 25 32 34 35 37 38; U43 4; USB1 A8 B8

## Via types
v1: diameter 0.5, hole 0.299, Top Layer to Bottom Layer, 464 vias
v2: diameter 0.75, hole 0.5, Top Layer to Bottom Layer, 13 vias
v3: diameter 0.5, hole 0.3, Top Layer to Bottom Layer, 117 vias

## Routing (per net, layer and track width the routed paths; a pad name or vN(x,y) marks a point on that pad's centre or on a via; arc(x,y) is an arc through that point)
$1I35159\1V1: length 27.6
  Top Layer w0.15: U40.50 158.18,49.82 v1(157.4,50.6) 156.6,51.4 156.6,51.46 ; U40.45 160.18,49.78 v1(161,50.6) 161.6,51.2 161.6,51.46 ; v3(161.32,38.43) 160.6,39.15 C6.2 160.6,39.55 159.54,40.61 159.18,40.61 158.98,40.82 U40.23
  Inner2 w0.2: v1(161,50.6) v1(157.4,50.6) ; v3(161.75,41.7) 161.32,41.28 v3(161.32,38.43)
  Bottom Layer w0.3: v3(161.75,41.7) 161.8,41.75 161.8,49.8 v1(161,50.6)
$1I35159\3V3: length 51.3
  Top Layer w0.15: v1(156,47.5) 155.96,47.54 U40.1 154.73,47.54 153.4,48.86 C16.2 ; v1(160.5,60) 162.03,60 U42.8 ; v1(157.9,42.4) 158.13,42.4 158.58,41.96 U40.22 158.58,40.8 159.6,39.77 C14.2 ; v3(162.34,34.89) 162.72,34.51 R5.2 ; 157.6,51.46 158.58,50.48 U40.49 158.58,47.72 v1(158.8,47.5) 158.98,47.68 U40.48 158.98,51.08 158.6,51.46 ; FPC2.2 FPC2.6 v3(156.65,29.93) ; FPC3.5 v3(152.15,27.8) ; 160.74,47.54 160.98,47.78 U40.43 160.98,48.83 163.6,51.46 ; 160.74,47.54 v1(160.7,47.5) 160.58,47.62 U40.44 160.58,49.43 162.6,51.46 ; 160.74,47.54 U40.42 161.93,48.46 163.41,49.95 C12.2 ; v1(160.7,44.3) 161.06,43.94 U40.33 163.02,43.94 C13.2 ; v1(156,44.23) 155.71,43.94 U40.10 153.79,43.94 C15.2
  Top Layer w0.5: v1(157.99,65.6) U39.4 154.01,65.6 C4.2 154,65.37 154,64.6 v1(154.3,64.3) ; U39.2 162.37,65.73 v1(161.4,66.7)
$1I35159\5V: length 198.9
  Top Layer w0.15: U43.6 161.9,82.53 161.52,82.15 160.33,82.15 160.2,82.28 160.2,84.6 U43.3
  Top Layer w0.5: CN1.1 163.01,70.31 C3.2 163,68.53 U39.3
  Top Layer w0.6: CN1.1 164.05,73.74 164.05,78.86 CN1.1
  Inner2 w0.3: v3(157.65,60) 156.25,61.4 v3(153.55,61.4)
  Bottom Layer w0.15: C20.2 156.35,57.82 156.35,52.45 157.88,50.93 157.88,49.83 C21.2 ; C20.2 157.65,59.12 v3(157.65,60) ; C20.2 159.23,59.12 LED4.3 ; 103.96,91.12 103.93,91.15 103.93,93.6 v1(102.78,93.6) ; 27.96,53.12 27.93,53.15 27.93,55.6 v1(26.78,55.6) ; v1(83.78,36.6) 84.93,36.6 84.93,34.15 84.96,34.12 ; 122.96,72.12 122.93,72.15 122.93,74.6 v1(121.78,74.6) ; 84.96,91.12 84.93,91.15 84.93,93.6 v1(83.78,93.6) ; C21.2 157.65,44.87 155.97,43.2 155.97,42.8 157.65,41.13 C22.2 LED6.3 ; C21.2 LED5.3 ; 46.96,34.12 46.93,34.15 46.93,36.6 v1(45.78,36.6) ; v1(156.1,89.1) 156.15,89.1 C17.2 LED1.3 ; 27.96,91.12 27.93,91.15 27.93,93.6 v1(26.78,93.6) ; 122.96,34.12 122.93,34.15 122.93,36.6 v1(121.78,36.6) ; v1(102.78,74.6) 103.93,74.6 103.93,72.15 103.96,72.12 ; 8.91,34.12 8.88,34.15 8.88,36.6 v1(7.72,36.6) ; 27.96,72.12 27.93,72.15 27.93,74.6 v1(26.78,74.6) ; 122.94,15.12 122.91,15.15 122.91,17.6 v1(121.75,17.6) ; 141.94,72.12 141.91,72.15 141.91,74.6 v1(140.75,74.6) ; 65.96,53.12 65.93,53.15 65.93,55.6 v1(64.78,55.6) ; v1(102.78,36.6) 103.93,36.6 103.93,34.15 103.96,34.12 ; 46.96,53.12 46.93,53.15 46.93,55.6 v1(45.78,55.6) ; 65.96,72.12 65.93,72.15 65.93,74.6 v1(64.78,74.6) ; 46.94,15.12 46.91,15.15 46.91,17.6 v1(45.75,17.6) ; v1(156.1,70.1) 157.6,68.6 C19.2 LED3.3 ; v1(64.78,36.6) 65.93,36.6 65.93,34.15 65.96,34.12 ; LED2.3 C18.2 157.65,77.16 v1(157.64,77.16) ; 46.96,72.12 46.93,72.15 46.93,74.6 v1(45.78,74.6) ; 84.96,53.12 84.93,53.15 84.93,55.6 v1(83.78,55.6) ; v1(83.75,17.6) 84.91,17.6 84.91,15.15 84.94,15.12 ; v1(26.78,36.6) 27.93,36.6 27.93,34.15 27.96,34.12 ; 141.94,53.12 141.91,53.15 141.91,55.6 v1(140.75,55.6) ; v1(83.78,74.6) 84.93,74.6 84.93,72.15 84.96,72.12 ; v1(64.75,17.6) 65.91,17.6 65.91,15.15 65.94,15.12 ; v1(7.7,17.6) C24.2 8.86,15.15 LED45.3 ; 122.96,53.12 122.93,53.15 122.93,55.6 v1(121.78,55.6) ; 65.96,91.12 65.93,91.15 65.93,93.6 v1(64.78,93.6) ; v1(45.78,93.6) 46.93,93.6 46.93,91.15 46.96,91.12 ; v1(121.78,93.6) 122.93,93.6 122.93,91.15 122.96,91.12 ; 27.94,15.12 27.91,15.15 27.91,17.6 v1(26.75,17.6) ; v1(7.72,55.6) 8.88,55.6 8.88,53.15 8.91,53.12 ; v1(7.72,74.6) 8.88,74.6 8.88,72.15 8.91,72.12 ; v1(102.78,55.6) 103.93,55.6 103.93,53.15 103.96,53.12 ; 141.94,91.12 141.91,91.15 141.91,93.6 v1(140.75,93.6) ; 103.94,15.12 103.91,15.15 103.91,17.6 v1(102.75,17.6) ; v1(7.72,93.6) 8.88,93.6 8.88,91.15 8.91,91.12
  vias: v2(161.85,79.95) v2(161.88,80.95) v2(162.3,74.6) v2(163.1,74.6)
$1I35159\$1N1: length 3
  Top Layer w0.15: U40.47 159.38,51.14 R1.2
$1I35159\$1N6: length 2.8
  Top Layer w0.15: U41.3 157.6,38.06 157.71,38.17 R3.2
$1I35159\$1N17: length 13.6
  Top Layer w0.15: USB1.A5 159.15,89.45 158.3,90.3 153.2,90.3 152.5,89.61 152.5,87.62 154.5,85.62 154.5,85.53
$1I35159\$1N18: length 2.8
  Top Layer w0.15: 155.5,85.53 156.15,86.18 USB1.B5
$1I35159\$1N2773: length 3.2
  Top Layer w0.15: U40.46 159.78,50.54 R2.2
$1I35159\$1N2838: length 1.8
  Top Layer w0.15: BOOT.2 163.58,32.22 R4.2
$1I35159\$1N29010: length 1.8
  Top Layer w0.6: F1.2 162.56,84.34 U43.1
$1I35159\$6N6477: length 14.6
  Bottom Layer w0.15: LED2.4 162.5,78.1 163.7,76.9 163.7,74.2 160,70.5 160,68.24 159.46,67.7 LED3.2
$1I35159\$6N6478: length 12.1
  Bottom Layer w0.15: LED3.4 161.1,68.25 161.24,68.25 161.88,67.62 161.88,66.5 161.2,65.83 161.2,61.78 159.88,60.45 159.88,58.68 159.39,58.2 LED4.2
$1I35159\$6N6479: length 11.2
  Bottom Layer w0.15: LED2.2 159.39,77.2 160,77.81 160,86.85 160.12,86.98 160.12,87.12 160.26,87.25 160.4,87.25 LED1.4
$1I35159\$6N6480: length 11.8
  Bottom Layer w0.15: LED4.4 160.89,59.1 161.4,58.59 161.4,54.17 160.68,53.45 160.68,50.95 160,50.27 160,49.24 159.52,48.76 159.31,48.76 LED5.2
$1I35159\$6N6482: length 22.1
  Bottom Layer w0.15: LED9.2 145.7,67.41 145.7,65.8 147.5,64 147.5,57.23 LED8.4
$1I35159\$6N6483: length 31.6
  Top Layer w0.15: v3(149.4,39.3) v3(155.2,39.3)
  Bottom Layer w0.15: LED6.4 161,40.1 161.8,39.3 161.8,38.23 161.52,37.95 156.55,37.95 v3(155.2,39.3) ; v3(149.4,39.3) 149.4,41.7 145.7,45.4 145.7,48.41 LED8.2
$1I35159\$6N6484: length 22.1
  Bottom Layer w0.15: LED10.2 145.7,86.41 145.7,84.8 147.5,83 147.5,76.23 LED9.4
$1I35159\$6N6485: length 26.8
  Bottom Layer w0.15: LED12.4 106.5,92.24 106.5,93.75 106.15,94.09 88.32,94.09 85.68,91.46 85.68,90.87 85.03,90.22 LED13.2
$1I35159\$6N6486: length 17.8
  Bottom Layer w0.15: 103.84,71.23 103.7,71.23 102.8,72.12 LED22.4
$1I35159\$6N6487: length 17.8
  Bottom Layer w0.15: LED23.4 121.8,72.12 122.7,71.23 122.84,71.23
$1I35159\$6N6488: length 17.8
  Bottom Layer w0.15: 84.84,71.23 84.7,71.23 83.8,72.12 LED21.4
$1I35159\$6N6489: length 24.5
  Bottom Layer w0.15: LED25.2 122.74,52.22 120.75,54.21 120.75,59.95 126.6,65.8 126.6,70.35 124.83,72.12 LED24.4
$1I35159\$6N6490: length 26.6
  Bottom Layer w0.15: LED27.4 87.18,53.12 87.9,52.4 87.9,51.5 87.37,50.97 76.13,50.97 74.8,52.3 72.2,52.3 70.87,50.97 67.13,50.97 LED28.2
$1I35159\$6N6491: length 26.8
  Bottom Layer w0.15: LED29.2 47.03,52.22 47.68,52.87 47.68,53.46 50.32,56.09 68.15,56.09 68.5,55.75 68.5,54.23 LED28.4
$1I35159\$6N6492: length 26.8
  Bottom Layer w0.15: LED26.4 106.5,54.23 106.5,55.75 106.15,56.09 88.32,56.09 85.68,53.46 85.68,52.87 85.03,52.22 LED27.2
$1I35159\$6N6493: length 26.6
  Bottom Layer w0.15: LED29.4 49.18,53.12 49.9,52.4 49.9,51.5 49.37,50.97 38.13,50.97 36.8,52.3 34.2,52.3 32.87,50.97 29.13,50.97 LED30.2
$1I35159\$6N6494: length 17.8
  Bottom Layer w0.15: LED32.4 26.8,34.12 27.7,33.23 27.84,33.23
$1I35159\$6N6495: length 17.8
  Bottom Layer w0.15: LED33.4 45.8,34.12 46.7,33.23 46.84,33.23
$1I35159\$6N6496: length 24.4
  Bottom Layer w0.15: LED32.2 8.74,33.22 6.75,35.21 6.75,40.95 12.6,46.8 12.6,51.3 10.78,53.12 LED31.4
$1I35159\$6N6497: length 17.8
  Bottom Layer w0.15: LED34.4 64.8,34.12 65.7,33.23 65.84,33.23
$1I35159\$6N6498: length 17.8
  Bottom Layer w0.15: LED37.4 121.8,34.12 122.7,33.23 122.84,33.23
$1I35159\$6N6499: length 24.5
  Bottom Layer w0.15: LED39.2 122.74,14.22 120.75,16.21 120.75,21.95 126.6,27.8 126.6,32.35 124.83,34.12 LED38.4
$1I35159\$6N6500: length 17.8
  Bottom Layer w0.15: 103.84,33.23 103.7,33.23 102.8,34.12 LED36.4
$1I35159\$6N6501: length 26.6
  Bottom Layer w0.15: LED40.2 105.13,12.97 108.87,12.97 110.2,14.3 112.8,14.3 114.13,12.97 125.37,12.97 125.9,13.5 125.9,14.4 125.18,15.12 LED39.4
$1I35159\$6N6502: length 26.8
  Bottom Layer w0.15: LED42.4 68.5,16.24 68.5,17.75 68.15,18.09 50.32,18.09 47.68,15.46 47.68,14.87 47.03,14.22 LED43.2
$1I35159\$6N6503: length 26.6
  Bottom Layer w0.15: LED43.4 49.18,15.12 49.9,14.4 49.9,13.5 49.37,12.97 38.13,12.97 36.8,14.3 34.2,14.3 32.87,12.97 29.13,12.97 LED44.2
$1I35159\$6N6504: length 26.6
  Bottom Layer w0.15: LED41.4 87.18,15.12 87.9,14.4 87.9,13.5 87.37,12.97 76.13,12.97 74.8,14.3 72.2,14.3 70.87,12.97 67.13,12.97 LED42.2
$1I35159\$6N6505: length 26.8
  Bottom Layer w0.15: LED45.2 9.03,14.22 9.68,14.87 9.68,15.46 12.32,18.09 30.15,18.09 30.5,17.75 30.5,16.24 LED44.4
$1I35159\$6N6506: length 17.8
  Bottom Layer w0.15: LED19.2 27.74,71.22 26.85,72.11 10.43,72.11
$1I35159\$6N6507: length 24.9
  Bottom Layer w0.15: LED12.2 105.13,88.97 124.93,88.97 125.65,89.69 125.65,90.55 125.08,91.12 LED11.4
$1I35159\$6N6508: length 26.8
  Bottom Layer w0.15: LED14.4 68.5,92.24 68.5,93.75 68.15,94.09 50.32,94.09 47.68,91.46 47.68,90.87 47.03,90.22 LED15.2
$1I35159\$6N6509: length 24.9
  Bottom Layer w0.15: LED14.2 67.13,88.97 86.93,88.97 87.65,89.69 87.65,90.55 87.08,91.12 LED13.4
$1I35159\$6N6510: length 17.8
  Bottom Layer w0.15: 46.84,71.23 46.7,71.23 45.8,72.12 LED19.4
$1I35159\$6N6511: length 24.4
  Bottom Layer w0.15: LED17.4 10.78,91.12 12.6,89.3 12.6,84.8 6.75,78.95 6.75,73.21 8.74,71.22 LED18.2
$1I35159\$6N6512: length 26.8
  Bottom Layer w0.15: LED17.2 9.03,90.22 9.68,90.87 9.68,91.46 12.32,94.09 30.15,94.09 30.5,93.75 30.5,92.24 LED16.4
$1I35159\$6N6513: length 8.5
  Top Layer w0.15: 153.5,85.53 153.5,85.6 v3(152.6,86.5)
  Bottom Layer w0.15: LED1.2 156.3,86.7 155.75,87.25 154.4,87.25 153.85,86.7 152.8,86.7 v3(152.6,86.5)
$1I35159\$6N6516: length 11.7
  Bottom Layer w0.15: LED6.2 159.39,39.2 160,39.81 160,40.7 161.38,42.08 161.38,49.12 160.89,49.6 LED5.4
$1I35159\$6N6517: length 26.8
  Bottom Layer w0.15: LED11.2 123.03,90.22 123.68,90.87 123.68,91.46 126.32,94.09 144.13,94.09 144.5,93.72 144.5,92.24 LED10.4
$1I35159\$6N6518: length 24.9
  Bottom Layer w0.15: LED15.4 49.08,91.12 49.65,90.55 49.65,89.69 48.93,88.97 29.13,88.97 LED16.2
$1I35159\$6N6519: length 17.8
  Bottom Layer w0.15: 65.84,71.23 65.7,71.23 64.8,72.12 LED20.4
$1I35159\$6N6520: length 26.6
  Bottom Layer w0.15: LED26.2 105.13,50.97 108.87,50.97 110.2,52.3 112.8,52.3 114.13,50.97 125.37,50.97 125.9,51.5 125.9,52.4 125.18,53.12 LED25.4
$1I35159\$6N6521: length 26.8
  Bottom Layer w0.15: LED30.4 30.5,54.23 30.5,55.75 30.15,56.09 12.32,56.09 9.68,53.46 9.68,52.87 9.03,52.22 LED31.2
$1I35159\$6N6522: length 17.8
  Bottom Layer w0.15: LED35.4 83.8,34.12 84.7,33.23 84.84,33.23
$1I35159\$6N6523: length 26.8
  Bottom Layer w0.15: LED41.2 85.03,14.22 85.68,14.87 85.68,15.46 88.32,18.09 106.15,18.09 106.5,17.75 106.5,16.24 LED40.4
$1I35159\$7N3321: length 3.6
  Top Layer w0.15: D1.2 2.5,83.4 U1.1
$1I35159\$7N3322: length 3.6
  Top Layer w0.15: U3.1 2.5,45.4 D3.2
$1I35159\$7N3323: length 3.6
  Top Layer w0.15: D4.2 2.5,26.4 U4.1
$1I35159\$7N3324: length 3.6
  Top Layer w0.15: U5.1 2.5,7.4 D5.2
$1I35159\$7N3325: length 3.6
  Top Layer w0.15: D6.2 21.5,83.4 U6.1
$1I35159\$7N3326: length 3.6
  Top Layer w0.15: D7.2 21.5,64.4 U7.1
$1I35159\$7N3327: length 3.6
  Top Layer w0.15: U8.1 21.5,45.4 D8.2
$1I35159\$7N3328: length 3.6
  Top Layer w0.15: U9.1 21.5,26.4 D9.2
$1I35159\$7N3329: length 3.6
  Top Layer w0.15: D10.2 21.5,7.4 U10.1
$1I35159\$7N3330: length 3.6
  Top Layer w0.15: U11.1 40.5,83.4 D11.2
$1I35159\$7N3331: length 3.6
  Top Layer w0.15: U12.1 40.5,64.4 D12.2
$1I35159\$7N3332: length 3.6
  Top Layer w0.15: U13.1 40.5,45.4 D13.2
$1I35159\$7N3333: length 3.6
  Top Layer w0.15: U14.1 40.5,26.4 D14.2
$1I35159\$7N3334: length 3.6
  Top Layer w0.15: D15.2 40.5,7.4 U15.1
$1I35159\$7N3335: length 3.6
  Top Layer w0.15: D16.2 59.5,83.4 U16.1
$1I35159\$7N3336: length 3.6
  Top Layer w0.15: D17.2 59.5,64.4 U17.1
$1I35159\$7N3337: length 3.6
  Top Layer w0.15: D18.2 59.5,45.4 U18.1
$1I35159\$7N3338: length 3.6
  Top Layer w0.15: D19.2 59.5,26.4 U19.1
$1I35159\$7N3339: length 3.6
  Top Layer w0.15: U20.1 59.5,7.4 D20.2
$1I35159\$7N3340: length 3.6
  Top Layer w0.15: D21.2 78.5,83.4 U21.1
$1I35159\$7N3341: length 3.6
  Top Layer w0.15: D22.2 78.5,64.4 U22.1
$1I35159\$7N3342: length 3.6
  Top Layer w0.15: D23.2 78.5,45.4 U23.1
$1I35159\$7N3343: length 3.6
  Top Layer w0.15: D24.2 78.5,26.4 U24.1
$1I35159\$7N3344: length 3.6
  Top Layer w0.15: U25.1 78.5,7.4 D25.2
$1I35159\$7N3345: length 3.6
  Top Layer w0.15: D26.2 97.5,83.4 U26.1
$1I35159\$7N3346: length 3.6
  Top Layer w0.15: D27.2 97.5,64.4 U27.1
$1I35159\$7N3347: length 3.6
  Top Layer w0.15: U28.1 97.5,45.4 D28.2
$1I35159\$7N3348: length 3.6
  Top Layer w0.15: D29.2 97.5,26.4 U29.1
$1I35159\$7N3349: length 3.6
  Top Layer w0.15: U30.1 97.5,7.4 D30.2
$1I35159\$7N3350: length 3.5
  Top Layer w0.15: 116.6,83.49 116.5,83.59 D31.2 ; 116.5,83.4 U31.1
$1I35159\$7N3351: length 3.6
  Top Layer w0.15: U32.1 116.5,64.4 D32.2
$1I35159\$7N3352: length 3.6
  Top Layer w0.15: U33.1 116.5,45.4 D33.2
$1I35159\$7N3353: length 3.6
  Top Layer w0.15: D34.2 116.5,26.4 U34.1
$1I35159\$7N3354: length 3.6
  Top Layer w0.15: U35.1 116.5,7.4 D35.2
$1I35159\$7N3355: length 3.6
  Top Layer w0.15: D36.2 135.5,83.4 U36.1
$1I35159\$7N3356: length 3.6
  Top Layer w0.15: U37.1 135.5,64.4 D37.2
$1I35159\$7N3357: length 3.6
  Top Layer w0.15: U38.1 135.5,45.4 D38.2
$1I35159\$7N3358: length 1.5
  Bottom Layer w0.15: D39.2 SW8.1
$1I35159\$7N3359: length 1.6
  Bottom Layer w0.15: D41.2 158.87,90.8 SW3.1
$1I35159\$7N3360: length 1.5
  Bottom Layer w0.15: D42.2 SW4.1
$1I35159\$7N3361: length 1.5
  Bottom Layer w0.15: D43.2 SW5.1
$1I35159\$7N3362: length 1.5
  Bottom Layer w0.15: D44.2 SW6.1
$1I35159\$7N3363: length 1.5
  Bottom Layer w0.15: D45.2 SW7.1
$1I35159\$7N3393: length 3.6
  Top Layer w0.15: U2.1 2.5,64.4 D2.2
$1I35159\COL1: length 228.2
  Top Layer w0.15: v3(16.6,69.3) 16.6,62.51 U2.2 16.6,60.76 ; v3(16.6,31.3) 16.6,24.5 U4.2 16.6,22.75 v3(16.6,13.7) ; 16.6,60.76 18.06,59.3 150,59.3 152.1,57.2 152.1,48.45 154.21,46.34 U40.4 ; 16.6,60.76 v3(16.6,51.7) ; v3(16.6,70.7) 16.6,79.76 U1.2 ; v3(16.6,32.7) 16.6,41.76 U3.2 16.6,43.51 v3(16.6,50.3) ; v3(16.6,12.3) 16.6,5.5 U5.2
  Bottom Layer w0.15: v3(16.6,69.3) v3(16.6,70.7) ; v3(16.6,12.3) v3(16.6,13.7) ; v3(16.6,31.3) v3(16.6,32.7) ; v3(16.6,50.3) v3(16.6,51.7)
$1I35159\COL2: length 208.7
  Top Layer w0.15: U6.2 35.6,79.76 v3(35.6,70.7) ; v3(35.6,50.3) 35.6,43.51 U8.2 35.6,41.76 v3(35.6,32.7) ; v3(35.6,51.7) v3(35.6,58.8) 35.8,59 149.8,59 151.8,57 151.8,48.32 154.19,45.94 U40.5 ; v3(35.6,69.3) 35.6,62.51 U7.2 35.6,60.76 v3(35.6,59.8) ; v3(35.6,31.3) 35.6,24.5 U9.2 35.6,22.75 v3(35.6,13.7) ; v3(35.6,12.3) 35.6,5.5 U10.2
  Bottom Layer w0.15: v3(35.6,12.3) v3(35.6,13.7) ; v3(35.6,69.3) v3(35.6,70.7) ; v3(35.6,50.3) v3(35.6,51.7) ; v3(35.6,58.8) v3(35.6,59.8) ; v3(35.6,31.3) v3(35.6,32.7)
$1I35159\COL3: length 189.7
  Top Layer w0.15: v3(54.6,70.7) 54.6,79.76 U11.2 ; v3(54.6,69.3) 54.6,62.51 U12.2 54.6,60.76 v3(54.6,59.8) ; v3(54.6,32.7) 54.6,41.76 U13.2 54.6,43.51 v3(54.6,50.3) ; U40.6 154.16,45.54 151.5,48.2 151.5,56.8 149.6,58.7 54.8,58.7 v3(54.6,58.5) v3(54.6,51.7) ; v3(54.6,31.3) 54.6,24.5 U14.2 54.6,22.75 v3(54.6,13.7) ; v3(54.6,12.3) 54.6,5.5 U15.2
  Bottom Layer w0.15: v3(54.6,31.3) v3(54.6,32.7) ; v3(54.6,50.3) v3(54.6,51.7) ; v3(54.6,12.3) v3(54.6,13.7) ; v3(54.6,69.3) v3(54.6,70.7) ; v3(54.6,58.5) v3(54.6,59.8)
$1I35159\COL4: length 170.7
  Top Layer w0.15: U16.2 73.6,79.76 v3(73.6,70.7) ; v3(73.6,51.7) v3(73.6,58.2) 73.8,58.4 149.48,58.4 151.2,56.68 151.2,48.08 154.14,45.14 U40.7 ; v3(73.6,31.3) 73.6,24.5 U19.2 73.6,22.75 v3(73.6,13.7) ; v3(73.6,12.3) 73.6,5.5 U20.2 ; v3(73.6,69.3) 73.6,62.51 U17.2 73.6,60.76 v3(73.6,59.8) ; v3(73.6,32.7) 73.6,41.76 U18.2 73.6,43.51 v3(73.6,50.3)
  Bottom Layer w0.15: v3(73.6,58.2) v3(73.6,59.8) ; v3(73.6,31.3) v3(73.6,32.7) ; v3(73.6,50.3) v3(73.6,51.7) ; v3(73.6,12.3) v3(73.6,13.7) ; v3(73.6,69.3) v3(73.6,70.7)
$1I35159\COL5: length 151.8
  Top Layer w0.15: v3(92.6,69.3) 92.6,62.51 U22.2 92.6,60.76 v3(92.6,59.8) ; v3(92.6,31.3) 92.6,24.5 U24.2 92.6,22.75 v3(92.6,13.7) ; v3(92.6,50.3) 92.6,43.51 U23.2 92.6,41.76 v3(92.6,32.7) ; v3(92.6,12.3) 92.6,5.5 U25.2 ; U21.2 92.6,79.76 v3(92.6,70.7) ; U40.8 154.11,44.74 150.9,47.95 150.9,56.55 149.35,58.1 92.8,58.1 v3(92.6,57.9) v3(92.6,51.7)
  Bottom Layer w0.15: v3(92.6,70.7) v3(92.6,69.3) ; v3(92.6,57.9) v3(92.6,59.8) ; v3(92.6,51.7) v3(92.6,50.3) ; v3(92.6,32.7) v3(92.6,31.3) ; v3(92.6,13.7) v3(92.6,12.3)
$1I35159\COL6: length 132.8
  Top Layer w0.15: v3(111.6,70.7) 111.6,79.76 U26.2 ; v3(111.6,51.7) v3(111.6,57.6) 111.8,57.8 149.2,57.8 150.6,56.4 150.6,47.83 154.09,44.34 U40.9 ; v3(111.6,59.8) 111.6,60.76 U27.2 111.6,62.51 v3(111.6,69.3) ; v3(111.6,32.7) 111.6,41.76 U28.2 111.6,43.51 v3(111.6,50.3) ; v3(111.6,12.3) 111.6,5.5 U30.2 ; v3(111.6,13.7) 111.6,22.75 U29.2 111.6,24.5 v3(111.6,31.3)
  Bottom Layer w0.15: v3(111.6,31.3) v3(111.6,32.7) ; v3(111.6,69.3) v3(111.6,70.7) ; v3(111.6,12.3) v3(111.6,13.7) ; v3(111.6,57.6) v3(111.6,59.8) ; v3(111.6,50.3) v3(111.6,51.7)
$1I35159\COL7: length 117.8
  Top Layer w0.15: v3(130.6,59.8) 130.6,60.76 U32.2 130.6,62.51 v3(130.6,69.3) ; v3(130.6,50.3) 130.6,43.51 U33.2 130.6,41.76 v3(130.6,32.7) ; v3(130.6,51.7) v3(130.6,57.3) 130.8,57.5 149,57.5 150.3,56.2 150.3,44.57 153.63,41.24 155.63,41.24 U40.15 ; U31.2 130.6,79.76 v3(130.6,70.7) ; v3(130.6,31.3) 130.6,24.5 U34.2 130.6,22.75 v3(130.6,13.7) ; U35.2 130.6,5.5 v3(130.6,12.3)
  Bottom Layer w0.15: v3(130.6,57.3) v3(130.6,59.8) ; v3(130.6,12.3) v3(130.6,13.7) ; v3(130.6,31.3) v3(130.6,32.7) ; v3(130.6,50.3) v3(130.6,51.7) ; v3(130.6,69.3) v3(130.6,70.7)
$1I35159\COL8: length 65.5
  Top Layer w0.15: v3(149.6,69.2) 149.6,62.51 U37.2 149.5,60.86 v3(149.5,59.8) ; v3(149.55,56.15) 149.55,43.46 U38.2 150.46,40.9 v3(152.9,40.9) 153.2,40.6 155.96,40.6 156.18,40.82 U40.16 ; U36.2 149.6,79.76 v3(149.6,70.6)
  Inner2 w0.15: v3(155.2,38.6) v3(152.9,40.9)
  Bottom Layer w0.15: v3(149.5,59.8) 149.55,59.75 v3(149.55,56.15) ; SW8.2 163.28,39.29 160.72,36.73 157.11,36.73 155.23,38.6 ; v3(149.6,70.6) v3(149.6,69.2)
$1I35159\COL9: length 49.1
  Top Layer w0.15: U40.36 162.84,45.14 v3(162.9,45.2)
  Bottom Layer w0.15: 162.55,52.75 v3(161.6,53.7) 163.28,55.39 SW6.2 SW5.2 164,72.47 164,80.54 SW4.2 163.28,87.61 163.29,87.62 163.29,89.61 163.28,89.62 SW3.2 ; 162.55,52.75 SW7.2 ; 162.55,52.75 162.9,52.4 v3(162.9,45.2)
$1I35159\DI: length 39.7
  Top Layer w0.15: R9.2 152.4,83.57 152.4,48.57 154.23,46.74 U40.3
$1I35159\JOY_B: length 48.3
  Top Layer w0.15: FPC3.3 v3(151.15,28.3) 144.45,28.3 142.88,26.72 137.57,26.72 H1.2 ; v3(164.1,46.9) 163.86,47.14 U40.41
  Bottom Layer w0.15: v3(164.1,46.9) 164.32,46.68 164.32,33.28 159.43,28.38 151.22,28.38 v3(151.15,28.3)
$1I35159\JOY_X: length 47.8
  Top Layer w0.15: v3(150.65,30.4) FPC3.2 ; FPC2.1 FPC2.5 156.15,30.35 v3(156.1,30.4) ; U40.40 163.26,46.74 v3(163.8,46.2)
  Inner2 w0.15: v3(163.8,46.2) 163.8,46.15 164.03,45.93 164.03,33.48 160.95,30.4 v3(156.1,30.4)
  Bottom Layer w0.15: v3(156.1,30.4) v3(150.65,30.4) 140.7,30.4 H1.3
$1I35159\JOY_Y: length 45.7
  Top Layer w0.15: FPC2.3 FPC2.7 v3(157.15,30.95) ; FPC3.6 v3(152.65,30.95) 143.25,30.95 H1.4 ; v3(163.5,45.5) 162.66,46.34 U40.39
  Inner2 w0.15: v3(157.15,30.95) 157.18,30.93 161.05,30.93 163.73,33.6 163.73,45.27 v3(163.5,45.5)
  Bottom Layer w0.15: v3(157.15,30.95) v3(152.65,30.95)
$1I35159\QSPI_CLK: length 14
  Top Layer w0.15: v3(158.93,57.27) 155.71,54.05 155.71,50.8 157.38,49.13 U40.52 ; U42.6 161.97,57.4 v3(160.4,57.4)
  Bottom Layer w0.15: v3(160.4,57.4) 159.06,57.4 v3(158.93,57.27)
$1I35159\QSPI_CS: length 41.9
  Top Layer w0.15: v3(162.83,35.38) 163.58,34.62 R5.1 163.58,33.67 162.72,32.81 R4.1 ; U40.56 155.78,49.03 154.3,50.51 v1(154.3,51.5) 154.3,54.44 153.02,55.72 153.02,58.36 154.67,60.01 U42.1
  Inner2 w0.15: v3(152.2,43.8) v3(152.2,41.95)
  Bottom Layer w0.15: v3(152.2,43.8) 152.2,49.4 v1(154.3,51.5) ; v3(152.2,41.95) 152.2,39.83 152.5,39.52 152.53,39.52 155.65,36.4 161.8,36.4 v3(162.83,35.38)
$1I35159\QSPI_IO0: length 14
  Top Layer w0.15: U40.53 156.98,49.1 155.41,50.67 155.41,54.58 v3(156.96,56.14) ; v3(159.2,56.14) 161.97,56.14 U42.5
  Bottom Layer w0.15: v3(159.2,56.14) v3(156.96,56.14)
$1I35159\QSPI_IO1: length 12.3
  Top Layer w0.15: U40.55 156.18,49.06 154.81,50.43 154.81,54.36 153.32,55.85 153.32,57.39 154.67,58.73 U42.2
$1I35159\QSPI_IO2: length 10.9
  Top Layer w0.15: U40.54 156.58,49.08 155.11,50.55 155.11,54.49 153.62,55.97 153.62,56.42 154.67,57.47 U42.3
$1I35159\QSPI_IO3: length 14
  Top Layer w0.15: U40.51 157.78,49.15 156,50.92 156,53.68 161.06,58.73 U42.7
$1I35159\ROW1: length 226.8
  Top Layer w0.15: v3(151.11,67.33) 152.1,68.33 152.1,88.67 v3(151.8,88.97) D36.1 D31.1 D26.1 D21.1 D16.1 D11.1 D6.1 D1.1 ; U40.27 160.58,40.82 161.8,39.6 161.8,36.81 158.32,33.33 v3(151.3,33.33)
  Bottom Layer w0.15: v3(151.8,88.97) 153.63,90.8 D41.1 ; v3(151.11,67.33) 151.11,67.23 150.82,66.95 150.82,33.8 v3(151.3,33.33)
$1I35159\ROW2: length 217.1
  Top Layer w0.15: v3(151.1,68.1) v3(151.1,70) 151.07,69.97 D37.1 D32.1 D27.1 D22.1 D17.1 D12.1 D7.1 D2.1 ; v3(150.6,33.1) 150.88,32.83 158.24,32.83 162.1,36.68 162.1,39.72 160.98,40.84 U40.28
  Bottom Layer w0.15: v3(151.1,68.1) 150.41,67.41 150.41,33.29 v3(150.6,33.1) ; v3(151.1,70) 151.1,77.32 D42.1
$1I35159\ROW3: length 209.2
  Top Layer w0.15: v3(149.9,32.9) 150.32,32.48 158.32,32.48 162.4,36.56 162.4,41.86 U40.29 ; D3.1 D8.1 D13.1 D18.1 D23.1 D28.1 D33.1 D38.1 135.53,51 v3(148.9,51)
  Bottom Layer w0.15: v3(149.9,32.9) 149.9,50 v3(148.9,51) 150.07,52.18 150.07,67.95 153.88,71.75 D43.1
$1I35159\ROW4: length 206.6
  Top Layer w0.15: U40.30 162.49,42.74 162.7,42.53 162.7,36.44 158.29,32.03 116.55,32.03 D34.1 D29.1 D24.1 D19.1 D14.1 D9.1 D4.1
  Bottom Layer w0.15: D44.1 152,62.25 151.2,61.45 151.2,43.7 151.65,43.25 ; v3(151.8,32) 151.78,32.02 151.78,33.62 151.2,34.2 151.2,42.8 151.65,43.25 ; 151.65,43.25 D39.1
$1I35159\ROW5: length 211.5
  Top Layer w0.15: D5.1 D10.1 D15.1 D20.1 D25.1 D30.1 D35.1 130.67,12.97 131.2,13.5 131.2,31 131.7,31.5 v3(152.3,31.5) 158.19,31.5 163,36.31 163,42.73 162.59,43.14 U40.31
  Inner2 w0.15: v3(151.7,44.25) v3(151.7,41.38)
  Bottom Layer w0.15: D45.1 154.15,52.75 151.7,50.3 v3(151.7,44.25) ; v3(151.7,41.38) 151.7,34.35 152.3,33.75 v3(152.3,31.5)
$1I35159\SERIAL: length 39.5
  Top Layer w0.15: v3(159.5,69.6) 159.79,69.9 CN1.2 CN1.2 ; v3(157.9,69.6) 155.15,69.6 152.7,67.16 152.7,48.7 154.26,47.14 U40.2
  Bottom Layer w0.15: v3(159.5,69.6) v3(157.9,69.6)
$1I35159\USB_D+: length 44.6
  Top Layer w0.24: R1.1 159.6,52.86 159.81,53.06 159.81,53.46 161.34,55 162.9,55 163.7,55.8 163.7,60.5 163,61.2 160.94,61.2 158.51,63.63 158.51,84.59 156.95,86.15 D46.2 157.15,86.4 ; 157.15,86.4 158.15,87.4 USB1.A6 ; 157.15,86.4 USB1.B6
$1I35159\USB_D-: length 44.9
  Top Layer w0.24: USB1.A7 157.65,88.66 157.89,88.9 158.41,88.9 158.65,88.66 USB1.B7 158.65,86.4 D46.1 158.27,85.63 158.27,85.39 158.9,84.76 158.9,63.79 161.1,61.59 163.16,61.59 164.09,60.66 164.09,55.64 163.06,54.61 161.5,54.61 160.19,53.3 160.19,53.06 160.6,52.66 R2.1
$1I35159\VBUS: length 5.6
  Top Layer w0.6: v2(161.78,86.65) 160.8,86.65 160.3,87.15 USB1.A4B9 ; v2(155.5,86.65) 155.5,88.04
  Top Layer w0.75: v2(162.6,86.65) v2(161.78,86.65) ; v2(155.5,86.65) v2(154.65,86.65)
$1I35159\XIN: length 10
  Top Layer w0.15: U40.20 157.78,40.61 156.94,39.77 155.84,39.77 155.71,39.63 155.71,38.66 156.2,38.16 156.2,38.06 155.32,37.18 154.61,37.18 154.47,37.04 154.47,35.66 155.4,34.73 U41.1
$1I35159\XOUT: length 2.5
  Top Layer w0.15: U40.21 158.18,40.77 158.6,40.35 R3.1
$1N35205: length 3.2
  Top Layer w0.15: U40.17 156.58,40.8 156.08,40.3 154.63,40.3 R10.1
$1N35212: length 134.5
  Top Layer w0.15: v1(158.1,54.6) 157.6,54.1 C9.1 ; U41.4 155.58,36.35 156.9,37.67 v3(156.9,38.6) ; C1.2 156.36,39.14 v3(156.9,38.6) ; C12.1 v3(163.6,47.8) ; C13.1 163.56,44.49 v1(162.89,44.49) ; C6.1 C14.1 158.9,37.36 v1(158.9,37.2) 158.9,35.95 U41.2 ; U42.4 155.1,56.07 v1(155.1,55.4) ; R7.1 R8.1 ; R10.2 v1(152.7,40) ; C9.1 C10.1 ; C9.1 C5.1 ; 157.6,39.15 157.44,39.15 v3(156.9,38.6) ; v1(156.45,43) 157.38,42.07 U40.19 ; C7.1 C8.2 C11.1 ; 153.4,50.34 v1(153.4,51.3) ; 153.4,42.46 153.54,42.46 v1(154.2,41.8)
  Top Layer w0.3: v1(156.5,44.9) 158.34,44.9 U40.57 ; v1(156.6,46.8) 158.38,45.02 U40.57 ; v1(160.2,46.8) 160.2,46.76 158.4,44.96 ; U40.57 158.4,44.96 ; U40.57 160.16,44.94 v1(160.2,44.9) ; 158.4,44.96 v1(158.4,46.8) ; 158.4,44.91 156.49,43 v1(156.45,43) ; v1(162.45,64.4) 162.45,63.38 U39.1 162.37,62.88 161.7,62.21 v1(161.7,62.2)
  Top Layer w0.35: U43.2 v2(161.25,83.9) U43.5
  Top Layer w0.5: USB1.2 154.16,88.04 USB1.B1A12 ; D46.3 v1(157.9,83.12) ; C4.1 v1(154.79,67.78) ; v1(160.6,69.6) 160.9,69.6 C3.1 ; USB1.A1B12 161.65,88.04 USB1.1
  Top Layer w0.6: 156.59,73.19 156.3,72.9 v2(155.4,72.9) ; 156.59,73.19 CN1.3 ; 156.59,73.19 156.89,72.9 v2(157.8,72.9)
  Top Layer w0.75: v2(157.85,79.9) CN1.3 v2(155.4,79.9)
  Bottom Layer w0.15: 29.46,52.22 29.58,52.1 v1(30.17,52.1) ; v1(105.97,55.6) 105.02,55.6 ; v1(86.97,36.6) 86.02,36.6 ; 10.41,71.22 10.53,71.1 v1(11.12,71.1) ; v1(143.95,55.6) 143,55.6 ; v1(86.97,93.6) 86.02,93.6 ; 124.46,90.22 124.58,90.1 v1(125.18,90.1) ; v1(29.97,36.6) 29.02,36.6 ; 86.46,33.22 86.58,33.1 v1(87.18,33.1) ; v1(144.15,52.1) 143.56,52.1 143.44,52.22 ; v1(125.18,33.1) 124.58,33.1 124.46,33.22 ; v1(48.95,17.6) 48,17.6 ; 67.46,52.22 67.58,52.1 v1(68.18,52.1) ; v1(49.17,90.1) 48.58,90.1 48.46,90.22 ; v1(29.97,55.6) 29.02,55.6 ; 86.46,71.22 86.58,71.1 v1(87.18,71.1) ; v1(29.97,93.6) 29.02,93.6 ; LED6.1 160.15,38.6 v3(156.9,38.6) ; LED4.1 160.9,58.05 160.9,57.04 160.61,56.75 v1(160.4,56.75) ; v1(10.92,36.6) 9.97,36.6 ; 48.46,52.22 48.58,52.1 v1(49.17,52.1) ; v1(125.15,14.1) 124.56,14.1 124.44,14.22 ; v1(67.97,36.6) 67.02,36.6 ; v1(106.18,90.1) 105.58,90.1 105.46,90.22 ; v1(86.95,17.6) 86,17.6 ; v1(11.12,33.1) 10.53,33.1 10.41,33.22 ; 86.44,14.22 86.56,14.1 v1(87.15,14.1) ; 143.44,71.22 143.56,71.1 v1(144.15,71.1) ; 67.44,14.22 67.56,14.1 v1(68.15,14.1) ; v1(48.97,36.6) 48.02,36.6 ; v2(161.25,83.9) 161.25,86.2 LED1.1 ; 29.44,14.22 29.56,14.1 v1(30.15,14.1) ; v1(10.92,93.6) 9.97,93.6 ; 143.44,90.22 143.56,90.1 v1(144.15,90.1) ; v1(49.17,71.1) 48.58,71.1 48.46,71.22 ; v1(143.95,74.6) 143,74.6 ; v1(10.9,17.6) 9.94,17.6 ; 124.46,52.22 124.58,52.1 v1(125.18,52.1) ; v1(11.12,90.1) 10.53,90.1 10.41,90.22 ; v1(68.18,71.1) 67.58,71.1 67.46,71.22 ; v1(67.97,74.6) 67.02,74.6 ; v1(10.92,74.6) 9.97,74.6 ; v1(106.15,14.1) 105.56,14.1 105.44,14.22 ; v1(67.95,17.6) 67,17.6 ; v1(105.95,17.6) 105,17.6 ; v1(11.12,52.1) 10.53,52.1 10.41,52.22 ; v1(143.95,93.6) 143,93.6 ; v1(124.97,93.6) 124.02,93.6 ; v1(11.1,14.1) 10.5,14.1 LED45.1 ; 86.46,90.22 86.58,90.1 v1(87.18,90.1) ; v1(67.97,93.6) 67.02,93.6 ; 86.46,52.22 86.58,52.1 v1(87.18,52.1) ; 29.46,33.22 29.58,33.1 v1(30.17,33.1) ; v1(86.97,74.6) 86.02,74.6 ; C17.1 154.59,87.6 USB1.2 ; v1(67.97,55.6) 67.02,55.6 ; v1(30.17,90.1) 29.58,90.1 29.46,90.22 ; v1(124.95,17.6) 124,17.6 ; 67.46,33.22 67.58,33.1 v1(68.18,33.1) ; 29.46,71.22 29.58,71.1 v1(30.17,71.1) ; 67.46,90.22 67.58,90.1 v1(68.18,90.1) ; v1(124.97,74.6) 124.02,74.6 ; v1(106.18,33.1) 105.58,33.1 105.46,33.22 ; v1(160.2,46.8) 160.2,48.15 LED5.1 ; 124.46,71.22 124.58,71.1 v1(125.18,71.1) ; v1(10.92,55.6) 9.97,55.6 ; 48.46,33.22 48.58,33.1 v1(49.17,33.1) ; 105.46,52.22 105.58,52.1 v1(106.18,52.1) ; v1(48.97,93.6) 48.02,93.6 ; v1(124.97,36.6) 124.02,36.6 ; v1(105.97,36.6) 105.02,36.6 ; v1(105.97,74.6) 105.02,74.6 ; v1(29.95,17.6) 29,17.6 ; v1(48.97,74.6) 48.02,74.6 ; v1(48.97,55.6) 48.02,55.6 ; v1(124.97,55.6) 124.02,55.6 ; v1(29.97,74.6) 29.02,74.6 ; v1(49.15,14.1) 48.56,14.1 48.44,14.22 ; v1(106.18,71.1) 105.58,71.1 105.46,71.22 ; v1(105.97,93.6) 105.02,93.6 ; v1(86.97,55.6) 86.02,55.6
  vias: v1(2.5,90.1) v1(2.5,81.3) v1(2.5,71.1) v1(2.5,62.3) v1(2.5,52.1) v1(2.5,43.3) v1(2.5,33.1) v1(2.5,24.3) v1(2.5,14) v1(2.6,2.7) v1(6.58,85.51) v1(6.6,66.5) v1(6.6,47.5) v1(6.6,28.5) v1(6.6,9.5) v1(15.78,82.61) v1(15.8,78.7) v1(15.8,70.7) v1(15.8,69.3) v1(15.8,63.6) v1(15.8,59.6) v1(15.8,51.7) v1(15.8,50.3) v1(15.8,44.6) v1(15.8,40.7) v1(15.8,32.7) v1(15.8,31.3) v1(15.8,25.6) v1(15.8,21.7) v1(15.8,13.7) v1(15.8,12.3) v1(15.8,6.6) v1(17.38,89.71) v1(17.38,88.31) v1(17.38,78.71) v1(17.4,70.7) v1(17.4,69.3) v1(17.4,60.7) v1(17.4,58.8) v1(17.4,51.7) v1(17.4,50.3) v1(17.4,40.7) v1(17.4,32.7) v1(17.4,31.3) v1(17.4,21.7) v1(17.4,13.7) v1(17.4,12.3) v1(17.4,2.7) v1(25.58,85.51) v1(25.6,66.5) v1(25.6,47.5) v1(25.6,28.5) v1(25.6,9.5) v1(34.78,82.61) v1(34.8,78.7) v1(34.8,70.7) v1(34.8,69.3) v1(34.8,63.6) v1(34.8,58.3) v1(34.8,51.7) v1(34.8,50.3) v1(34.8,44.6) v1(34.8,32.7) v1(34.8,31.3) v1(34.8,25.6) v1(34.8,13.7) v1(34.8,12.3) v1(34.8,6.6) v1(36.38,89.71) v1(36.38,88.31) v1(36.38,78.71) v1(36.4,70.7) v1(36.4,69.3) v1(36.4,60.7) v1(36.4,58.3) v1(36.4,51.7) v1(36.4,50.3) v1(36.4,40.7) v1(36.4,32.7) v1(36.4,31.3) v1(36.4,21.7) v1(36.4,13.7) v1(36.4,12.3) v1(36.4,2.7) v1(44.58,85.51) v1(44.6,66.5) v1(44.6,47.5) v1(44.6,28.5) v1(44.6,9.5) v1(53.78,82.61) v1(53.8,78.7) v1(53.8,70.7) v1(53.8,69.3) v1(53.8,63.6) v1(53.8,58) v1(53.8,51.7) v1(53.8,50.3) v1(53.8,44.6) v1(53.8,32.7) v1(53.8,31.3) v1(53.8,25.6) v1(53.8,13.7) v1(53.8,12.3) v1(53.8,6.6) v1(55.38,89.71) v1(55.38,88.31) v1(55.38,78.71) v1(55.4,70.7) v1(55.4,69.3) v1(55.4,60.7) v1(55.4,58) v1(55.4,51.7) v1(55.4,50.3) v1(55.4,40.7) v1(55.4,32.7) v1(55.4,31.3) v1(55.4,21.7) v1(55.4,13.7) v1(55.4,12.3) v1(55.4,2.7) v1(63.58,85.51) v1(63.6,66.5) v1(63.6,47.5) v1(63.6,28.5) v1(63.6,9.5) v1(72.78,82.61) v1(72.8,70.7) v1(72.8,69.3) v1(72.8,63.6) v1(72.8,57.7) v1(72.8,51.7) v1(72.8,50.3) v1(72.8,44.6) v1(72.8,32.7) v1(72.8,31.3) v1(72.8,25.6) v1(72.8,13.7) v1(72.8,12.3) v1(72.8,6.6) v1(72.9,78.7) v1(74.38,89.71) v1(74.38,88.31) v1(74.38,78.71) v1(74.4,70.7) v1(74.4,69.3) v1(74.4,60.7) v1(74.4,57.7) v1(74.4,51.7) v1(74.4,50.3) v1(74.4,40.7) v1(74.4,32.7) v1(74.4,31.3) v1(74.4,21.7) v1(74.4,13.7) v1(74.4,12.3) v1(74.4,2.7) v1(82.58,85.51) v1(82.6,66.5) v1(82.6,47.5) v1(82.6,28.5) v1(82.6,9.5) v1(91.78,82.61) v1(91.8,70.7) v1(91.8,69.3) v1(91.8,63.6) v1(91.8,57.4) v1(91.8,51.7) v1(91.8,50.3) v1(91.8,44.6) v1(91.8,32.7) v1(91.8,31.3) v1(91.8,25.6) v1(91.8,13.7) v1(91.8,12.3) v1(91.8,6.6) v1(91.9,78.7) v1(93.38,89.71) v1(93.38,88.31) v1(93.38,78.71) v1(93.4,70.7) v1(93.4,69.3) v1(93.4,60.7) v1(93.4,57.4) v1(93.4,51.7) v1(93.4,50.3) v1(93.4,40.7) v1(93.4,32.7) v1(93.4,31.3) v1(93.4,21.7) v1(93.4,13.7) v1(93.4,12.3) v1(93.4,2.7) v1(101.58,85.51) v1(101.6,66.5) v1(101.6,47.5) v1(101.6,28.5) v1(101.6,9.5) v1(110.78,82.61) v1(110.8,78.7) v1(110.8,70.7) v1(110.8,69.3) v1(110.8,63.6) v1(110.8,57.1) v1(110.8,51.7) v1(110.8,50.3) v1(110.8,44.6) v1(110.8,32.7) v1(110.8,31.3) v1(110.8,25.6) v1(110.8,13.7) v1(110.8,12.3) v1(110.8,6.6) v1(112.38,89.71) v1(112.38,88.31) v1(112.38,78.71) v1(112.4,70.7) v1(112.4,69.3) v1(112.4,60.7) v1(112.4,57.1) v1(112.4,51.7) v1(112.4,50.3) v1(112.4,40.7) v1(112.4,32.7) v1(112.4,31.3) v1(112.4,21.7) v1(112.4,13.7) v1(112.4,12.3) v1(112.4,2.7) v1(120.58,85.51) v1(120.6,66.5) v1(120.6,47.5) v1(120.6,28.5) v1(120.6,9.5) v1(129.78,89.71) v1(129.78,88.31) v1(129.78,82.61) v1(129.8,78.7) v1(129.8,70.7) v1(129.8,69.3) v1(129.8,63.6) v1(129.8,56.8) v1(129.8,51.7) v1(129.8,50.3) v1(129.8,44.6) v1(129.8,32.7) v1(129.8,31.3) v1(129.8,25.6) v1(129.8,13.7) v1(129.8,12.3) v1(129.8,6.6) v1(130.6,2.7) v1(131.3,70.7) v1(131.3,69.3) v1(131.4,78.7) v1(131.4,60.7) v1(131.4,56.8) v1(131.4,51.7) v1(131.4,50.3) v1(131.4,32.7) v1(131.5,13) v1(132,30.7) v1(132.55,23.25) v1(139.6,85.5) v1(139.6,66.5) v1(139.6,47.5) v1(148.35,27.6) v1(148.8,82.5) v1(148.8,78.7) v1(148.8,70.6) v1(148.8,69.2) v1(148.8,63.6) v1(148.8,56.8) v1(148.9,51.8) v1(148.9,50.25) v1(149.05,44.35) v1(149.05,32.9) v1(149.4,38.6) v1(150.4,78.7) v1(150.4,70.6) v1(150.4,69.2) v1(151.4,88.3) v1(151.6,70.6) v1(151.8,89.8) v1(151.8,66.9) v1(151.8,58.5) v1(152.6,85.82) v1(152.68,38.6) v1(152.8,33.85) v1(152.9,83.3) v1(152.9,80.1) v1(152.9,70.1) v1(153.2,64.3) v1(153.2,60.1) v1(153.18,54.8) v1(154.5,77.3) v1(154.55,27.6) v1(155.2,37.9) v1(156.2,63.4) v1(156.86,57.09) v1(157.3,89.82) v1(157.9,70.3) v1(158,63.5) v1(159.5,64.1) v1(159.55,27.6) v1(159.7,35.5) v1(160.1,55) v1(160.8,60.7) v1(160.95,79.9) v1(161.2,74.7) v1(161.9,40.6) v1(162.8,66.8) v1(163.3,78.2) v1(164.1,70.6) v1(164.1,54.1) v1(164.15,64.4)
